# Altium project BEAGLEBONEBLACK_REV A5B.PrjPcb (part 3 of 5)

## Sheet P04_Processor 2 or 3, USB and Serial.SchDoc
size 513 x 386 mm
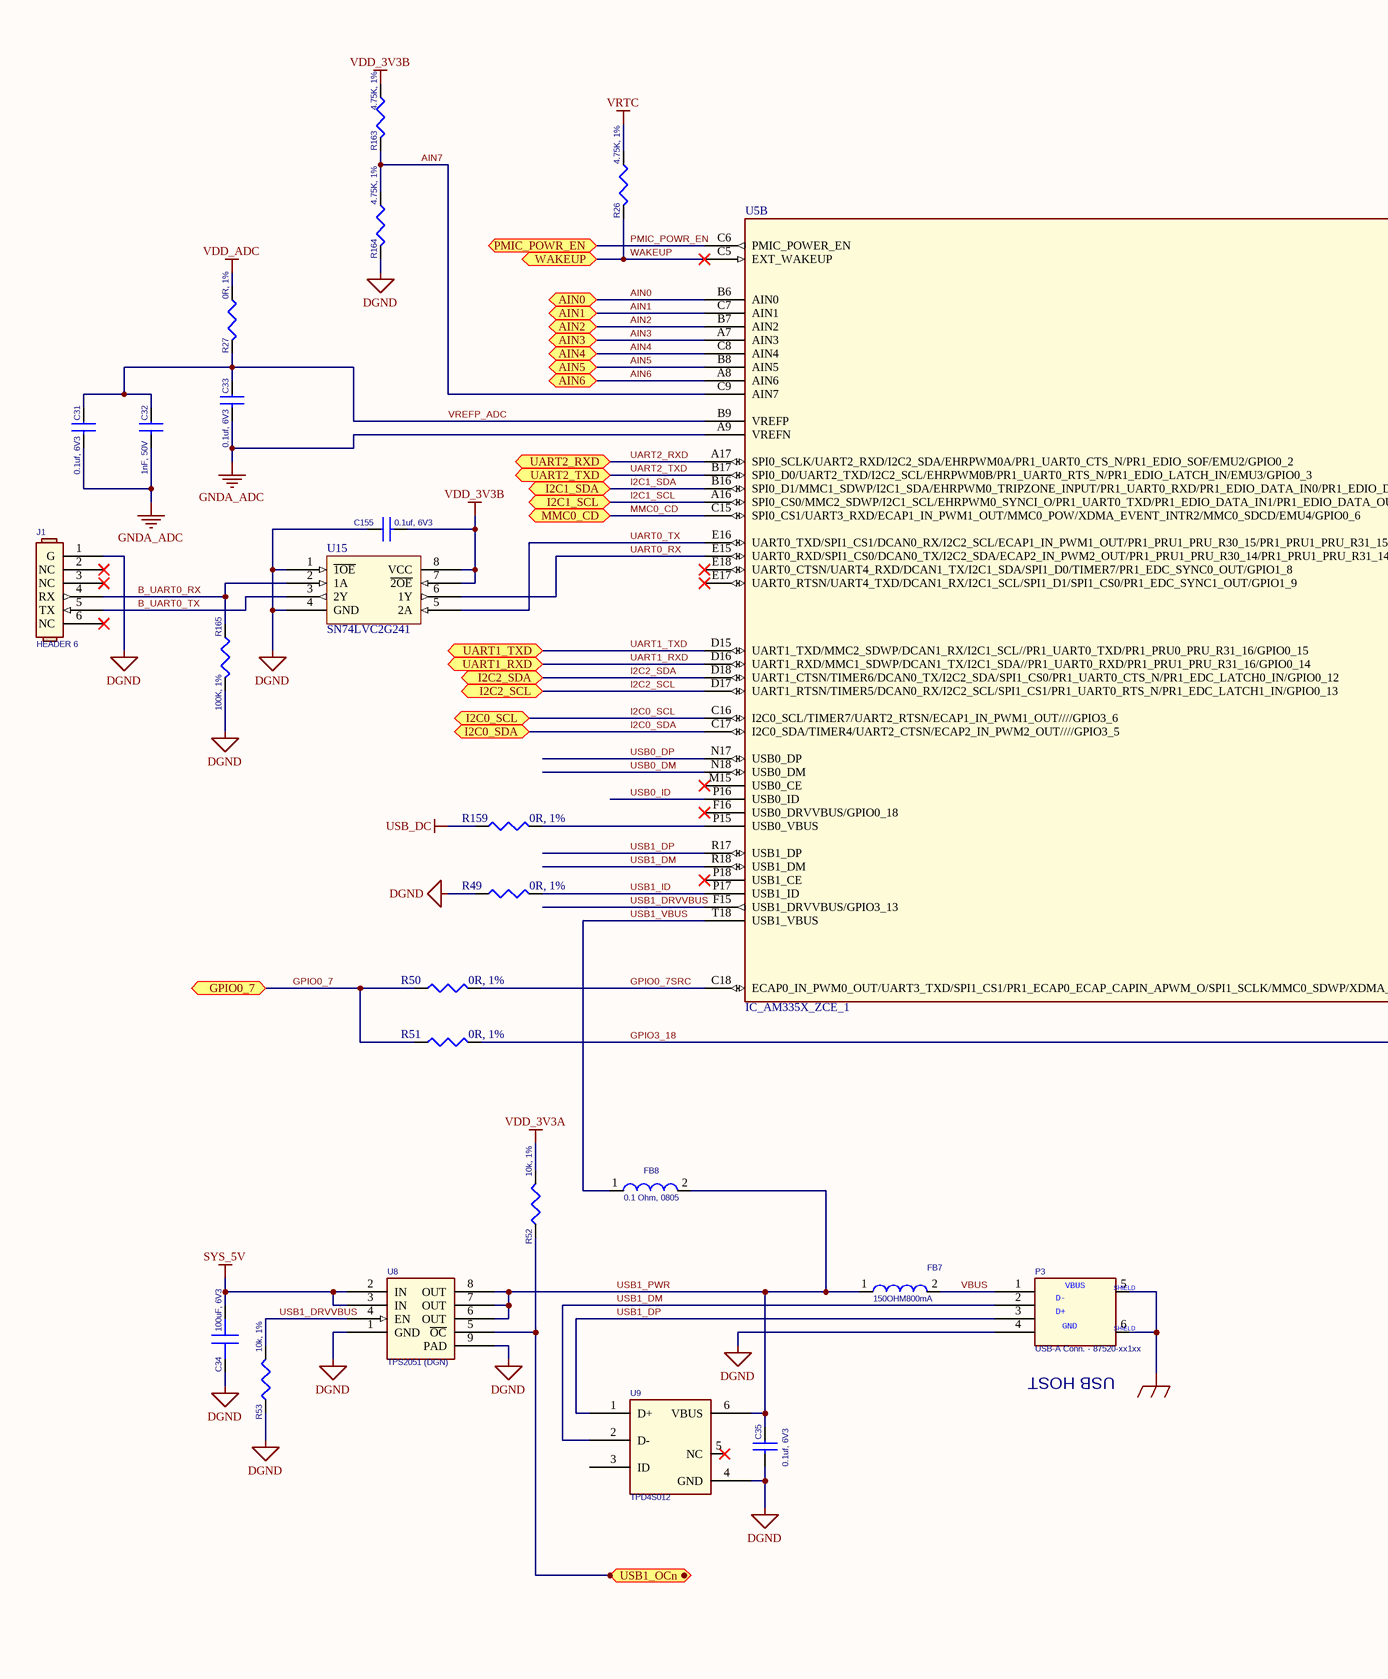
[diagram p3: P04_Processor 2 or 3, USB and Serial.SchDoc, left]
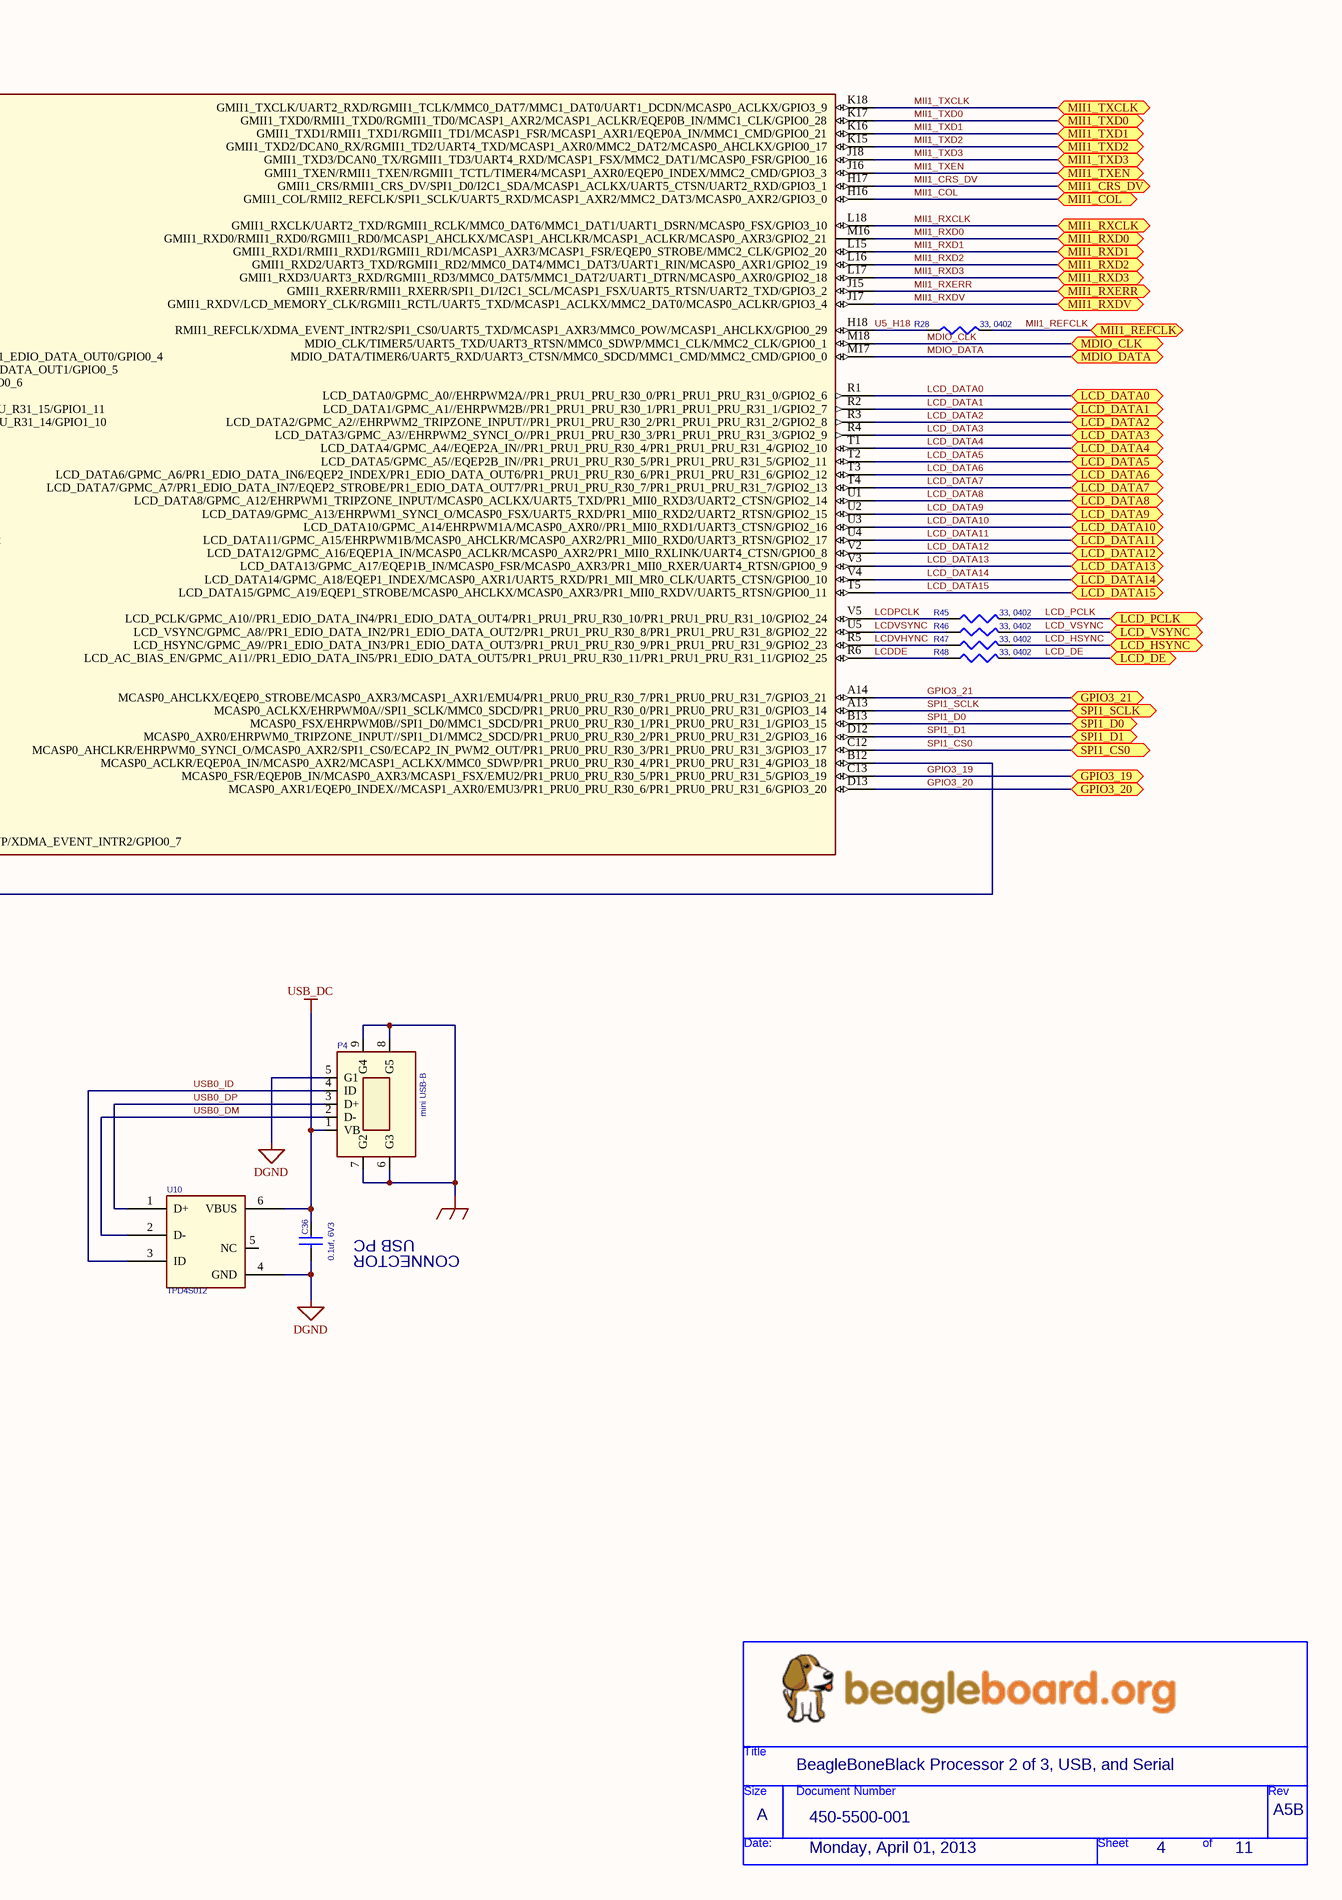
[diagram p4: P04_Processor 2 or 3, USB and Serial.SchDoc, right]

### Parts
(Parts that share a designator on the sheet are numbered #1, #2 ... from top to bottom, then left to right.)
*#4  Page Create Date: Monday, April 01, 2013  Doc: 450-5500-001  RevCode: A5B  Title: BeagleBoneBlack Processor 2 of 3, USB, and Serial  Page Size: A  Page Number: 4  Page Count: 11  (hidden comment: BeagleBoard_org)  (graphical)
C31  0.1uf, 6V3  [402]
C32  1nF, 50V  [402]
C33  0.1uf, 6V3  [402]
C34  100uF, 6V3  [RD205SMD_250D]
C35  0.1uf, 6V3  [402]
C36  0.1uf, 6V3  [402]
C155  0.1uf, 6V3  [402]
FB7  150OHM800mA  [SM-7351-IND-0805]
FB8  0.1 Ohm, 0805  [SM-7351-IND-0805]
J1  HEADER 6  [SIP6]
P3  USB-A Conn. - 87520-xx1xx  [usb_a_sh]
P4  mini USB-B  [USB5MINI_4SHIELDED_SMD-5]
R26  4.75K, 1%  [402]
R27  0R, 1%  [402]
R28  33, 0402  [402]
R45  33, 0402  [402]
R46  33, 0402  [402]
R47  33, 0402  [402]
R48  33, 0402  [402]
R49  0R, 1%  [402]
R50  0R, 1%  [402]
R51  0R, 1%  [402]
R52  10k, 1%  [402]
R53  10k, 1%  [402]
R159  0R, 1%  [402]
R163  4.75K, 1%  [402]
R164  4.75K, 1%  [402]
R165  100K, 1%  [402]
U5  IC_AM335X_ZCE_1  [am33xx_15x15]  (part B of 3)
U8  TPS2051 (DGN)  [DGN-16X60]
U9  TPD4S012  [U_6_DRY]
U10  TPD4S012  [U_6_DRY]
U15  SN74LVC2G241  [U_8_DCU]

### Ports
AIN0, AIN1, AIN2, AIN3, AIN4, AIN5, AIN6, GPIO0_7, GPIO3_19, GPIO3_20, GPIO3_21, I2C0_SCL, I2C0_SDA, I2C1_SCL, I2C1_SDA, I2C2_SCL, I2C2_SDA, LCD_DATA0, LCD_DATA1, LCD_DATA2, LCD_DATA3, LCD_DATA4, LCD_DATA5, LCD_DATA6, LCD_DATA7, LCD_DATA8, LCD_DATA9, LCD_DATA10, LCD_DATA11, LCD_DATA12, LCD_DATA13, LCD_DATA14, LCD_DATA15, LCD_DE, LCD_HSYNC, LCD_PCLK, LCD_VSYNC, MDIO_CLK, MDIO_DATA, MII1_COL, MII1_CRS_DV, MII1_REFCLK, MII1_RXCLK, MII1_RXD0, MII1_RXD1, MII1_RXD2, MII1_RXD3, MII1_RXDV, MII1_RXERR, MII1_TXCLK, MII1_TXD0, MII1_TXD1, MII1_TXD2, MII1_TXD3, MII1_TXEN, MMC0_CD, PMIC_POWR_EN, SPI1_CS0, SPI1_D0, SPI1_D1, SPI1_SCLK, UART1_RXD, UART1_TXD, UART2_RXD, UART2_TXD, USB1_OCn, WAKEUP

### Nets
DGND: C34.2 C35.2 C36.2 C155.1 J1.1(G) P3.4(P4) P4.5(G1) R49.1 R53.2(P2) R164.2 R165.2 U8.1(GND) U8.9(PAD) U9.4(GND) U10.4(GND) U15.1(~{1OE}) U15.4(GND)
GND_EARTH: P3.5(SHELD1) P3.6(PAD4) P4.6(G3) P4.7(G2) P4.8(G5) P4.9(G4)
GNDA_ADC: C31.2 C32.2 C33.2 U5.A9(VREFN)
SYS_5V: C34.1 U8.2(IN) U8.3(IN)
USB_DC: C36.1 P4.1(VB) R159.1 U10.6(VBUS)
VDD_3V3A: R52.1(P1)
VDD_3V3B: C155.2 R163.1 U15.7(~{2OE}) U15.8(VCC)
VDD_ADC: R27.1
VRTC: R26.1
AIN0: U5.B6(AIN0) ; port AIN0
AIN1: U5.C7(AIN1) ; port AIN1
AIN2: U5.B7(AIN2) ; port AIN2
AIN3: U5.A7(AIN3) ; port AIN3
AIN4: U5.C8(AIN4) ; port AIN4
AIN5: U5.B8(AIN5) ; port AIN5
AIN6: U5.A8(AIN6) ; port AIN6
AIN7: R163.2 R164.1 U5.C9(AIN7)
B_UART0_RX: J1.4(RX) R165.1 U15.2(1A)
B_UART0_TX: J1.5(TX) U15.3(2Y)
GPIO0_7: R50.1 R51.1 ; port GPIO0_7
GPIO0_7SRC: R50.2 U5.C18(ECAP0_IN_PWM0_OUT/UART3_TXD/SPI1_CS1/PR1_ECAP0_ECAP_CAPIN_APWM_O/SPI1_SCLK/MMC0_SDWP/XDMA_EVENT_INTR2/GPIO0_7)
GPIO3_18: R51.2 U5.B12(MCASP0_ACLKR/EQEP0A_IN/MCASP0_AXR2/MCASP1_ACLKX/MMC0_SDWP/PR1_PRU0_PRU_R30_4/PR1_PRU0_PRU_R31_4/GPIO3_18)
GPIO3_19: U5.C13(MCASP0_FSR/EQEP0B_IN/MCASP0_AXR3/MCASP1_FSX/EMU2/PR1_PRU0_PRU_R30_5/PR1_PRU0_PRU_R31_5/GPIO3_19) ; port GPIO3_19
GPIO3_20: U5.D13(MCASP0_AXR1/EQEP0_INDEX//MCASP1_AXR0/EMU3/PR1_PRU0_PRU_R30_6/PR1_PRU0_PRU_R31_6/GPIO3_20) ; port GPIO3_20
GPIO3_21: U5.A14(MCASP0_AHCLKX/EQEP0_STROBE/MCASP0_AXR3/MCASP1_AXR1/EMU4/PR1_PRU0_PRU_R30_7/PR1_PRU0_PRU_R31_7/GPIO3_21) ; port GPIO3_21
I2C0_SCL: U5.C16(I2C0_SCL/TIMER7/UART2_RTSN/ECAP1_IN_PWM1_OUT////GPIO3_6) ; port I2C0_SCL
I2C0_SDA: U5.C17(I2C0_SDA/TIMER4/UART2_CTSN/ECAP2_IN_PWM2_OUT////GPIO3_5) ; port I2C0_SDA
I2C1_SCL: U5.A16(SPI0_CS0/MMC2_SDWP/I2C1_SCL/EHRPWM0_SYNCI_O/PR1_UART0_TXD/PR1_EDIO_DATA_IN1/PR1_EDIO_DATA_OUT1/GPIO0_5) ; port I2C1_SCL
I2C1_SDA: U5.B16(SPI0_D1/MMC1_SDWP/I2C1_SDA/EHRPWM0_TRIPZONE_INPUT/PR1_UART0_RXD/PR1_EDIO_DATA_IN0/PR1_EDIO_DATA_OUT0/GPIO0_4) ; port I2C1_SDA
I2C2_SCL: U5.D17(UART1_RTSN/TIMER5/DCAN0_RX/I2C2_SCL/SPI1_CS1/PR1_UART0_RTS_N/PR1_EDC_LATCH1_IN/GPIO0_13) ; port I2C2_SCL
I2C2_SDA: U5.D18(UART1_CTSN/TIMER6/DCAN0_TX/I2C2_SDA/SPI1_CS0/PR1_UART0_CTS_N/PR1_EDC_LATCH0_IN/GPIO0_12) ; port I2C2_SDA
LCD_DATA0: U5.R1(LCD_DATA0/GPMC_A0//EHRPWM2A//PR1_PRU1_PRU_R30_0/PR1_PRU1_PRU_R31_0/GPIO2_6) ; port LCD_DATA0
LCD_DATA1: U5.R2(LCD_DATA1/GPMC_A1//EHRPWM2B//PR1_PRU1_PRU_R30_1/PR1_PRU1_PRU_R31_1/GPIO2_7) ; port LCD_DATA1
LCD_DATA2: U5.R3(LCD_DATA2/GPMC_A2//EHRPWM2_TRIPZONE_INPUT//PR1_PRU1_PRU_R30_2/PR1_PRU1_PRU_R31_2/GPIO2_8) ; port LCD_DATA2
LCD_DATA3: U5.R4(LCD_DATA3/GPMC_A3//EHRPWM2_SYNCI_O//PR1_PRU1_PRU_R30_3/PR1_PRU1_PRU_R31_3/GPIO2_9) ; port LCD_DATA3
LCD_DATA4: U5.T1(LCD_DATA4/GPMC_A4//EQEP2A_IN//PR1_PRU1_PRU_R30_4/PR1_PRU1_PRU_R31_4/GPIO2_10) ; port LCD_DATA4
LCD_DATA5: U5.T2(LCD_DATA5/GPMC_A5//EQEP2B_IN//PR1_PRU1_PRU_R30_5/PR1_PRU1_PRU_R31_5/GPIO2_11) ; port LCD_DATA5
LCD_DATA6: U5.T3(LCD_DATA6/GPMC_A6/PR1_EDIO_DATA_IN6/EQEP2_INDEX/PR1_EDIO_DATA_OUT6/PR1_PRU1_PRU_R30_6/PR1_PRU1_PRU_R31_6/GPIO2_12) ; port LCD_DATA6
LCD_DATA7: U5.T4(LCD_DATA7/GPMC_A7/PR1_EDIO_DATA_IN7/EQEP2_STROBE/PR1_EDIO_DATA_OUT7/PR1_PRU1_PRU_R30_7/PR1_PRU1_PRU_R31_7/GPIO2_13) ; port LCD_DATA7
LCD_DATA8: U5.U1(LCD_DATA8/GPMC_A12/EHRPWM1_TRIPZONE_INPUT/MCASP0_ACLKX/UART5_TXD/PR1_MII0_RXD3/UART2_CTSN/GPIO2_14) ; port LCD_DATA8
LCD_DATA9: U5.U2(LCD_DATA9/GPMC_A13/EHRPWM1_SYNCI_O/MCASP0_FSX/UART5_RXD/PR1_MII0_RXD2/UART2_RTSN/GPIO2_15) ; port LCD_DATA9
LCD_DATA10: U5.U3(LCD_DATA10/GPMC_A14/EHRPWM1A/MCASP0_AXR0//PR1_MII0_RXD1/UART3_CTSN/GPIO2_16) ; port LCD_DATA10
LCD_DATA11: U5.U4(LCD_DATA11/GPMC_A15/EHRPWM1B/MCASP0_AHCLKR/MCASP0_AXR2/PR1_MII0_RXD0/UART3_RTSN/GPIO2_17) ; port LCD_DATA11
LCD_DATA12: U5.V2(LCD_DATA12/GPMC_A16/EQEP1A_IN/MCASP0_ACLKR/MCASP0_AXR2/PR1_MII0_RXLINK/UART4_CTSN/GPIO0_8) ; port LCD_DATA12
LCD_DATA13: U5.V3(LCD_DATA13/GPMC_A17/EQEP1B_IN/MCASP0_FSR/MCASP0_AXR3/PR1_MII0_RXER/UART4_RTSN/GPIO0_9) ; port LCD_DATA13
LCD_DATA14: U5.V4(LCD_DATA14/GPMC_A18/EQEP1_INDEX/MCASP0_AXR1/UART5_RXD/PR1_MII_MR0_CLK/UART5_CTSN/GPIO0_10) ; port LCD_DATA14
LCD_DATA15: U5.T5(LCD_DATA15/GPMC_A19/EQEP1_STROBE/MCASP0_AHCLKX/MCASP0_AXR3/PR1_MII0_RXDV/UART5_RTSN/GPIO0_11) ; port LCD_DATA15
LCD_DE: R48.2 ; port LCD_DE
LCD_HSYNC: R47.2 ; port LCD_HSYNC
LCD_PCLK: R45.2 ; port LCD_PCLK
LCD_VSYNC: R46.2 ; port LCD_VSYNC
LCDDE: R48.1 U5.R6(LCD_AC_BIAS_EN/GPMC_A11//PR1_EDIO_DATA_IN5/PR1_EDIO_DATA_OUT5/PR1_PRU1_PRU_R30_11/PR1_PRU1_PRU_R31_11/GPIO2_25)
LCDPCLK: R45.1 U5.V5(LCD_PCLK/GPMC_A10//PR1_EDIO_DATA_IN4/PR1_EDIO_DATA_OUT4/PR1_PRU1_PRU_R30_10/PR1_PRU1_PRU_R31_10/GPIO2_24)
LCDVHYNC: R47.1 U5.R5(LCD_HSYNC/GPMC_A9//PR1_EDIO_DATA_IN3/PR1_EDIO_DATA_OUT3/PR1_PRU1_PRU_R30_9/PR1_PRU1_PRU_R31_9/GPIO2_23)
LCDVSYNC: R46.1 U5.U5(LCD_VSYNC/GPMC_A8//PR1_EDIO_DATA_IN2/PR1_EDIO_DATA_OUT2/PR1_PRU1_PRU_R30_8/PR1_PRU1_PRU_R31_8/GPIO2_22)
MDIO_CLK: U5.M18(MDIO_CLK/TIMER5/UART5_TXD/UART3_RTSN/MMC0_SDWP/MMC1_CLK/MMC2_CLK/GPIO0_1) ; port MDIO_CLK
MDIO_DATA: U5.M17(MDIO_DATA/TIMER6/UART5_RXD/UART3_CTSN/MMC0_SDCD/MMC1_CMD/MMC2_CMD/GPIO0_0) ; port MDIO_DATA
MII1_COL: U5.H16(GMII1_COL/RMII2_REFCLK/SPI1_SCLK/UART5_RXD/MCASP1_AXR2/MMC2_DAT3/MCASP0_AXR2/GPIO3_0) ; port MII1_COL
MII1_CRS_DV: U5.H17(GMII1_CRS/RMII1_CRS_DV/SPI1_D0/I2C1_SDA/MCASP1_ACLKX/UART5_CTSN/UART2_RXD/GPIO3_1) ; port MII1_CRS_DV
MII1_REFCLK: R28.2 ; port MII1_REFCLK
MII1_RXCLK: U5.L18(GMII1_RXCLK/UART2_TXD/RGMII1_RCLK/MMC0_DAT6/MMC1_DAT1/UART1_DSRN/MCASP0_FSX/GPIO3_10) ; port MII1_RXCLK
MII1_RXD0: U5.M16(GMII1_RXD0/RMII1_RXD0/RGMII1_RD0/MCASP1_AHCLKX/MCASP1_AHCLKR/MCASP1_ACLKR/MCASP0_AXR3/GPIO2_21) ; port MII1_RXD0
MII1_RXD1: U5.L15(GMII1_RXD1/RMII1_RXD1/RGMII1_RD1/MCASP1_AXR3/MCASP1_FSR/EQEP0_STROBE/MMC2_CLK/GPIO2_20) ; port MII1_RXD1
MII1_RXD2: U5.L16(GMII1_RXD2/UART3_TXD/RGMII1_RD2/MMC0_DAT4/MMC1_DAT3/UART1_RIN/MCASP0_AXR1/GPIO2_19) ; port MII1_RXD2
MII1_RXD3: U5.L17(GMII1_RXD3/UART3_RXD/RGMII1_RD3/MMC0_DAT5/MMC1_DAT2/UART1_DTRN/MCASP0_AXR0/GPIO2_18) ; port MII1_RXD3
MII1_RXDV: U5.J17(GMII1_RXDV/LCD_MEMORY_CLK/RGMII1_RCTL/UART5_TXD/MCASP1_ACLKX/MMC2_DAT0/MCASP0_ACLKR/GPIO3_4) ; port MII1_RXDV
MII1_RXERR: U5.J15(GMII1_RXERR/RMII1_RXERR/SPI1_D1/I2C1_SCL/MCASP1_FSX/UART5_RTSN/UART2_TXD/GPIO3_2) ; port MII1_RXERR
MII1_TXCLK: U5.K18(GMII1_TXCLK/UART2_RXD/RGMII1_TCLK/MMC0_DAT7/MMC1_DAT0/UART1_DCDN/MCASP0_ACLKX/GPIO3_9) ; port MII1_TXCLK
MII1_TXD0: U5.K17(GMII1_TXD0/RMII1_TXD0/RGMII1_TD0/MCASP1_AXR2/MCASP1_ACLKR/EQEP0B_IN/MMC1_CLK/GPIO0_28) ; port MII1_TXD0
MII1_TXD1: U5.K16(GMII1_TXD1/RMII1_TXD1/RGMII1_TD1/MCASP1_FSR/MCASP1_AXR1/EQEP0A_IN/MMC1_CMD/GPIO0_21) ; port MII1_TXD1
MII1_TXD2: U5.K15(GMII1_TXD2/DCAN0_RX/RGMII1_TD2/UART4_TXD/MCASP1_AXR0/MMC2_DAT2/MCASP0_AHCLKX/GPIO0_17) ; port MII1_TXD2
MII1_TXD3: U5.J18(GMII1_TXD3/DCAN0_TX/RGMII1_TD3/UART4_RXD/MCASP1_FSX/MMC2_DAT1/MCASP0_FSR/GPIO0_16) ; port MII1_TXD3
MII1_TXEN: U5.J16(GMII1_TXEN/RMII1_TXEN/RGMII1_TCTL/TIMER4/MCASP1_AXR0/EQEP0_INDEX/MMC2_CMD/GPIO3_3) ; port MII1_TXEN
MMC0_CD: U5.C15(SPI0_CS1/UART3_RXD/ECAP1_IN_PWM1_OUT/MMC0_POW/XDMA_EVENT_INTR2/MMC0_SDCD/EMU4/GPIO0_6) ; port MMC0_CD
PMIC_POWR_EN: U5.C6(PMIC_POWER_EN) ; port PMIC_POWR_EN
SPI1_CS0: U5.C12(MCASP0_AHCLKR/EHRPWM0_SYNCI_O/MCASP0_AXR2/SPI1_CS0/ECAP2_IN_PWM2_OUT/PR1_PRU0_PRU_R30_3/PR1_PRU0_PRU_R31_3/GPIO3_17) ; port SPI1_CS0
SPI1_D0: U5.B13(MCASP0_FSX/EHRPWM0B//SPI1_D0/MMC1_SDCD/PR1_PRU0_PRU_R30_1/PR1_PRU0_PRU_R31_1/GPIO3_15) ; port SPI1_D0
SPI1_D1: U5.D12(MCASP0_AXR0/EHRPWM0_TRIPZONE_INPUT//SPI1_D1/MMC2_SDCD/PR1_PRU0_PRU_R30_2/PR1_PRU0_PRU_R31_2/GPIO3_16) ; port SPI1_D1
SPI1_SCLK: U5.A13(MCASP0_ACLKX/EHRPWM0A//SPI1_SCLK/MMC0_SDCD/PR1_PRU0_PRU_R30_0/PR1_PRU0_PRU_R31_0/GPIO3_14) ; port SPI1_SCLK
U5_H18: R28.1 U5.H18(RMII1_REFCLK/XDMA_EVENT_INTR2/SPI1_CS0/UART5_TXD/MCASP1_AXR3/MMC0_POW/MCASP1_AHCLKX/GPIO0_29)
UART0_RX: U5.E15(UART0_RXD/SPI1_CS0/DCAN0_TX/I2C2_SDA/ECAP2_IN_PWM2_OUT/PR1_PRU1_PRU_R30_14/PR1_PRU1_PRU_R31_14/GPIO1_10) U15.6(1Y)
UART0_TX: U5.E16(UART0_TXD/SPI1_CS1/DCAN0_RX/I2C2_SCL/ECAP1_IN_PWM1_OUT/PR1_PRU1_PRU_R30_15/PR1_PRU1_PRU_R31_15/GPIO1_11) U15.5(2A)
UART1_RXD: U5.D16(UART1_RXD/MMC1_SDWP/DCAN1_TX/I2C1_SDA//PR1_UART0_RXD/PR1_PRU1_PRU_R31_16/GPIO0_14) ; port UART1_RXD
UART1_TXD: U5.D15(UART1_TXD/MMC2_SDWP/DCAN1_RX/I2C1_SCL//PR1_UART0_TXD/PR1_PRU0_PRU_R31_16/GPIO0_15) ; port UART1_TXD
UART2_RXD: U5.A17(SPI0_SCLK/UART2_RXD/I2C2_SDA/EHRPWM0A/PR1_UART0_CTS_N/PR1_EDIO_SOF/EMU2/GPIO0_2) ; port UART2_RXD
UART2_TXD: U5.B17(SPI0_D0/UART2_TXD/I2C2_SCL/EHRPWM0B/PR1_UART0_RTS_N/PR1_EDIO_LATCH_IN/EMU3/GPIO0_3) ; port UART2_TXD
USB0_DM: P4.2(D-) U5.N18(USB0_DM) U10.2(D-)
USB0_DP: P4.3(D+) U5.N17(USB0_DP) U10.1(D+)
USB0_ID: P4.4(ID) U5.P16(USB0_ID) U10.3(ID)
USB1_DM: P3.2(P2) U5.R18(USB1_DM) U9.2(D-)
USB1_DP: P3.3(P3) U5.R17(USB1_DP) U9.1(D+)
USB1_DRVVBUS: R53.1(P1) U5.F15(USB1_DRVVBUS/GPIO3_13) U8.4(EN)
USB1_ID: R49.2 U5.P17(USB1_ID)
USB1_OCn: R52.2(P2) U8.5(~{OC}) ; port USB1_OCn
USB1_PWR: C35.1 FB7.1 FB8.2 U8.6(OUT) U8.7(OUT) U8.8(OUT) U9.6(VBUS)
USB1_VBUS: FB8.1 U5.T18(USB1_VBUS)
VBUS: FB7.2 P3.1(P1)
VREFP_ADC: C31.1 C32.1 C33.1 R27.2 U5.B9(VREFP)
WAKEUP: R26.2 U5.C5(EXT_WAKEUP) ; port WAKEUP
NetR159_2: R159.2 U5.P15(USB0_VBUS)

Not connected (* = marked no-connect by the designer): J1 2(NC)* 3(NC)* 6(NC)*; U5 E17(UART0_RTSN/UART4_TXD/DCAN1_RX/I2C1_SCL/SPI1_D1/SPI1_CS0/PR1_EDC_SYNC1_OUT/GPIO1_9)* E18(UART0_CTSN/UART4_RXD/DCAN1_TX/I2C1_SDA/SPI1_D0/TIMER7/PR1_EDC_SYNC0_OUT/GPIO1_8)* F16(USB0_DRVVBUS/GPIO0_18)* M15(USB0_CE)* P18(USB1_CE)*; U9 3(ID) 5(NC)*; U10 5(NC)

### Notes on the sheet
- (near P3) USB HOST
- USB PC
- CONNECTOR
- (in symbol BeagleBoard_org) Title; Size; Document Number; Rev; Date:; Sheet; of
- (in symbol CONN_54819-0578_2) VBUS; SHIELD; D-; D+; GND

### Library data of the parts
C31 C33 C35 C36 C155 = CAP_0.1uF_X7R_16V_10% 0402: CAP CER 0.1UF 6.3V 10% X5R 0402; Manufacturer: TDK Corporation; Manufacturer Part Number: C1005X5R0J104K050BA; Capacitance: 0.1µF; Supplier 1: Digi-Key; Supplier Part Number 1: 445-1266-6-ND; RoHS: RoHS Compliant; Category: Capacitors; Stock 1: 127604; Pricing 1: 1=0.1, 10=0.026, 100=0.0121, 250=0.00992, 500=0.00848, 1000=0.0066, 5000=0.0055 (USD); Voltage - Rated: 6.3V; Tolerance: ±10%; Temperature Coefficient: X5R; Mounting Type: Surface Mount, MLCC; Operating Temperature: -55°C ~ 85°C; Applications: General Purpose; Ratings: -; Package / Case: 0402 (1005 Metric); Size / Dimension: 0.039" L x 0.020" W (1.00mm x 0.50mm); Height - Seated (Max): -; Thickness (Max): 0.022" (0.55mm); Lead Spacing: -; Features: -; Packaging: Digi-Reel®; Lead Style: -; ComponentLink1URL: http://product.tdk.com/capacitor/mlcc/en/documents/mlcc_commercial_general_en.pdf; ComponentLink1Description: http://product.tdk.com/capacitor/mlcc/en/documents/mlcc_commercial_general_en.pdf
C32 = CAP_0.001_X7R_50V_5%_0402: CAP CER 1000PF 16V 10% X7R 0402; Manufacturer: Yageo; Manufacturer Part Number: CC0402KRX7R7BB102; Supplier 1: Digi-Key; Supplier Part Number 1: 311-1352-6-ND; RoHS: RoHS Compliant; Category: Capacitors; Stock 1: 394472; Pricing 1: 1=0.1, 10=0.012, 25=0.0088, 100=0.0057, 250=0.00464, 500=0.00396, 1000=0.00309, 2500=0.00278, 5000=0.00258 (USD); Capacitance: 1000pF; Voltage - Rated: 16V; Tolerance: ±10%; Temperature Coefficient: X7R; Mounting Type: Surface Mount, MLCC; Operating Temperature: -55°C ~ 125°C; Applications: General Purpose; Ratings: -; Package / Case: 0402 (1005 Metric); Size / Dimension: 0.039" L x 0.020" W (1.00mm x 0.50mm); Height - Seated (Max): -; Thickness (Max): 0.022" (0.55mm); Lead Spacing: -; Features: -; Packaging: Digi-Reel®; Lead Style: -; ComponentLink1URL: http://www.yageo.com/documents/recent/UPY-GPHC_X7R_6.3V-to-50V_8.pdf; ComponentLink1Description: http://www.yageo.com/documents/recent/UPY-GPHC_X7R_6.3V-to-50V_8.pdf
C34 = CAP SMD: CAP ALUM 100UF 6.3V 20% SMD; Manufacturer: Cornell Dubilier Electronics (CDE); Manufacturer Part Number: AVE107M06D16T-F; Capacitance: 100µF; Lifetime @ Temp.: 2000 Hrs @ 85°C; Ripple Current: 120mA; ESR (Equivalent Series Resistance): 4.64 Ohm; Surface Mount Land Size: 0.260" L x 0.260" W (6.60mm x 6.60mm); Supplier 1: Digi-Key; Supplier Part Number 1: 338-1787-6-ND; RoHS: RoHS Compliant; Category: Capacitors; Stock 1: 2601; Pricing 1: 1=0.17, 10=0.16, 100=0.133, 250=0.11844, 500=0.0987 (USD); Voltage Rating: 6.3V; Tolerance: ±20%; Operating Temperature: -40°C ~ 85°C; Features: General Purpose; Impedance: -; Mounting Type: Surface Mount; Package / Case: Radial, Can - SMD; Size / Dimension: 0.248" Dia (6.30mm); Height - Seated (Max): 0.209" (5.30mm); Lead Spacing: -; Packaging: Digi-Reel®; ComponentLink1URL: http://www.cde.com/catalogs/AVE.pdf; ComponentLink1Description: http://www.cde.com/catalogs/AVE.pdf
FB7 = FER_180_200_0: FERRITE 800MA 150 OHM 0805 SMD; PartName: FerriteBead150ohm800mA; Mfr: Steward; MfrNum: LI0805H151R-10; TIIntPartnumber: 1L0010; Manufacturer: Laird-Signal Integrity Products; Vendor: Digikey; Impedance @ Frequency: 150 Ohm @ 100MHz; DC Resistance (DCR): 150 mOhm Max; Filter Type: Differential Mode - Single; Supplier 1: Digi-Key; Supplier Part Number 1: 240-2384-6-ND; Manufacturer Part Number: LI0805H151R-10; RoHS: RoHS Compliant; Category: Filters; Stock 1: 3694; Pricing 1: 1=0.1, 10=0.07, 25=0.064, 50=0.0574, 100=0.0421, 250=0.03064, 500=0.02808, 1000=0.02424 (USD); Current Rating: 800mA; Package / Case: 0805 (2012 Metric); Mounting Type: Surface Mount; Packaging: Digi-Reel®; Height (Max): 0.043" (1.10mm); Size / Dimension: 0.079" L x 0.049" W (2.00mm x 1.25mm); ComponentLink1URL: http://www.lairdtech.com/WorkArea/linkit.aspx?LinkIdentifier=id&ItemID=4912; ComponentLink1Description: http://www.lairdtech.com/WorkArea/linkit.aspx?LinkIdentifier=id&ItemID=4912
FB8 = FER_180_200_0: RES .10 OHM 1/8W 5% 0805; Manufacturer: CTS Resistor Products; Manufacturer Part Number: 73L3R10J; Resistance (Ohms): 0.1; Power (Watts): 0.125W, 1/8W; Temperature Coefficient: ±200ppm/°C; Supplier 1: Digi-Key; Supplier Part Number 1: 73L3R10JDKR-ND; RoHS: RoHS Compliant; Category: Resistors; Stock 1: 1186; Pricing 1: 1=0.1, 10=0.066, 100=0.0267, 250=0.0204, 500=0.01632, 1000=0.01201 (USD); Composition: Thick Film; Features: Current Sense; Tolerance: ±5%; Package / Case: 0805 (2012 Metric); Supplier Device Package: 0805; Size / Dimension: 0.079" L x 0.049" W (2.00mm x 1.25mm); Height: 0.026" (0.65mm); Number of Terminations: 2; Packaging: Digi-Reel®; ComponentLink1URL: http://www.ctscorp.com/components/Datasheets/008-0337-0.pdf; ComponentLink1Description: http://www.ctscorp.com/components/Datasheets/008-0337-0.pdf
J1 = HDR_6x1: CONN HEADER 6POS, VERTICAL,  .100 STR TIN; Manufacturer: Samtec Inc; Manufacturer Part Number: FTR-110-03-G-D-06; Connector Type: Unshrouded; Number of Positions: 20; Number of Positions Loaded: 19; Pitch: 0.050" (1.27mm); Row Spacing: 0.100" (2.54mm); Supplier 1: Digi-Key; Supplier Part Number 1: FTR-110-03-G-D-06-ND; RoHS: RoHS Compliant; Category: Connectors, Interconnects; Stock 1: 0; Pricing 1: 1=4.47 (USD); Number of Rows: 2; Contact Mating Length: 0.125" (3.18mm); Mounting Type: Surface Mount; Termination: Solder; Features: -; Contact Finish: Gold; Contact Finish Thickness: 10µin (0.25µm); Color: Black; Packaging: Tube; ComponentLink1URL: http://www.samtec.com/documents/webfiles/cpdf/FTR-1XX-XX-XX-D-X-XX-MKT.pdf; ComponentLink1Description: http://www.samtec.com/documents/webfiles/cpdf/FTR-1XX-XX-XX-D-X-XX-MKT.pdf; Height Stacking (Mating): -; Molding Height Above Board: 0.100" (2.54mm)
P3 = CONN_54819-0578_2: CONN RCPT USB TYPE A R/A PCB; Manufacturer: FCI; Manufacturer Part Number: 87520-0010BLF; CLASS: IO; TN: 224-0234-000; Number of Contacts: 4; Gender: Receptacle; Specifications: USB 2.0; Supplier 1: Digi-Key; Supplier Part Number 1: 609-1045-ND; RoHS: RoHS Compliant; Category: Connectors, Interconnects; Stock 1: 4363; Pricing 1: 1=0.78, 10=0.734, 25=0.6604, 50=0.587, 100=0.5626, 250=0.51368, 500=0.4892, 1000=0.40359, 2500=0.3669 (USD); Connector Type: USB - A; Mounting Type: Through Hole, Right Angle, Horizontal; Features: Board Lock; Packaging: Tube; Ingress Protection: -; ComponentLink1URL: http://portal.fciconnect.com/Comergent//fci/drawing/87520.pdf; ComponentLink1Description: http://portal.fciconnect.com/Comergent//fci/drawing/87520.pdf
P4 = MINI-USB-AB-SOCKET: CONN RCPT USB MINI B R/A SMD; Manufacturer: KYCON; Manufacturer Part Number: 0565790576; Order# 2: C-440247; ATLStockNo1: 4500.0223; Order#: KMAB-SMT-5S-S-30TR; Connector Type: USB - mini AB; Number of Contacts: 5; Gender: Receptacle; Specifications: USB 2.0 OTG; Manufacturer 2: AMP; Distributor: Deltron; Distributor 2: Tyco; Supplier 1: Digi-Key; Supplier Part Number 1: WM17122DKR-ND; RoHS: RoHS Compliant; Category: Connectors, Interconnects; Stock 1: 12426; Pricing 1: 1=2.92, 10=2.649, 25=2.4872, 50=2.3792, 100=2.271, 250=2.05468 (USD); Mounting Type: Surface Mount, Right Angle, Horizontal; Features: Shielded; Packaging: Digi-Reel®; Ingress Protection: -; ComponentLink1URL: http://www.molex.com/pdm_docs/sd/565790576_sd.pdf; ComponentLink1Description: http://www.molex.com/pdm_docs/sd/565790576_sd.pdf
R26 R163 R164 = RES_4.75K_1/16W_1%_0402: RES 4.75K OHM 1/16W 1% 0402 SMD; Manufacturer: Stackpole Electronics Inc; Manufacturer Part Number: RMCF0402FT4K75; Power (Watts): 0.063W, 1/16W; Temperature Coefficient: ±100ppm/°C; Supplier 1: Digi-Key; Supplier Part Number 1: RMCF0402FT4K75DKR-ND; RoHS: RoHS Compliant; Category: Resistors; Stock 1: 280917; Pricing 1: 1=0.04, 10=0.025, 50=0.0138, 100=0.0105, 250=0.0078, 500=0.00576, 1000=0.00384, 2500=0.00324, 5000=0.0027 (USD); Resistance (Ohms): 4.75k; Composition: Thick Film; Features: -; Tolerance: ±1%; Package / Case: 0402 (1005 Metric); Supplier Device Package: 0402; Size / Dimension: 0.039" L x 0.020" W (1.00mm x 0.50mm); Height: 0.016" (0.40mm); Number of Terminations: 2; Packaging: Digi-Reel®; ComponentLink1URL: http://www.seielect.com/Catalog/SEI-RMCF_RMCP.pdf; ComponentLink1Description: http://www.seielect.com/Catalog/SEI-RMCF_RMCP.pdf
R27 = RES_0_1/16W_1%_0402: RES 0.0 OHM 1/16W 0402 SMD; Manufacturer: Yageo; Manufacturer Part Number: RC0402JR-070RL; Resistance (Ohms): 0.0; Power (Watts): 0.063W, 1/16W; Tolerance: Jumper; Supplier 1: Digi-Key; Supplier Part Number 1: 311-0.0JRDKR-ND; RoHS: RoHS Compliant; Category: Resistors; Stock 1: 4904429; Pricing 1: 1=0.1, 10=0.012, 25=0.0092, 100=0.0055, 250=0.00476, 500=0.00336, 1000=0.00237, 2500=0.00206, 5000=0.00178 (USD); Composition: Thick Film; Features: -; Temperature Coefficient: -; Package / Case: 0402 (1005 Metric); Supplier Device Package: 0402; Size / Dimension: 0.039" L x 0.020" W (1.00mm x 0.50mm); Height: 0.016" (0.40mm); Number of Terminations: 2; Packaging: Digi-Reel®; ComponentLink1URL: http://www.yageo.com/documents/recent/PYu-RC0402_51_RoHS_L_6.pdf; ComponentLink1Description: http://www.yageo.com/documents/recent/PYu-RC0402_51_RoHS_L_6.pdf
R28 R45-R48 = RES_33_0402: RES 33 OHM 1/16W 5% 0402 SMD; Manufacturer: Panasonic Electronic Components; Manufacturer Part Number: ERJ-2GEJ330X; Resistance (Ohms): 33; Power (Watts): 0.1W, 1/10W; Temperature Coefficient: ±200ppm/°C; Supplier 1: Digi-Key; Supplier Part Number 1: P33JDKR-ND; RoHS: RoHS Compliant; Category: Resistors; Stock 1: 5879945; Pricing 1: 1=0.1, 50=0.0172, 100=0.0131, 250=0.00976, 500=0.0072, 1000=0.0048, 5000=0.00338 (USD); Composition: Thick Film; Features: -; Tolerance: ±5%; Package / Case: 0402 (1005 Metric); Supplier Device Package: 0402; Size / Dimension: 0.039" L x 0.020" W (1.00mm x 0.50mm); Height: 0.016" (0.40mm); Number of Terminations: 2; Packaging: Digi-Reel®; ComponentLink1URL: http://industrial.panasonic.com/www-cgi/jvcr13pz.cgi?E+PZ+3+AOA0001+ERJ2GEJ330X+7+WW; ComponentLink1Description: http://industrial.panasonic.com/www-cgi/jvcr13pz.cgi?E+PZ+3+AOA0001+ERJ2GEJ330X+7+WW
R49-R51 R159 = RES_0_1/16W_1%_0402: RES 0.0 OHM 1/16W 0402 SMD; Manufacturer: Yageo; Manufacturer Part Number: RC0402JR-070RL; Power (Watts): 0.063W, 1/16W; Resistance (Ohms): 0.0; Tolerance: Jumper; Category: Resistors; ComponentLink1Description: http://www.yageo.com/documents/recent/PYu-RC0402_51_RoHS_L_6.pdf; ComponentLink1URL: http://www.yageo.com/documents/recent/PYu-RC0402_51_RoHS_L_6.pdf; Composition: Thick Film; Features: -; Height: 0.016" (0.40mm); Number of Terminations: 2; Package / Case: 0402 (1005 Metric); Packaging: Digi-Reel®; Pricing 1: 1=0.1, 10=0.012, 25=0.0092, 100=0.0055, 250=0.00476, 500=0.00336, 1000=0.00237, 2500=0.00206, 5000=0.00178 (USD); RoHS: RoHS Compliant; Size / Dimension: 0.039" L x 0.020" W (1.00mm x 0.50mm); Stock 1: 4904429; Supplier 1: Digi-Key; Supplier Device Package: 0402; Supplier Part Number 1: 311-0.0JRDKR-ND; Temperature Coefficient: -
R52 R53 = RES SMD: RES 10K OHM 1/16W 5% 0402 SMD; Manufacturer: Rohm Semiconductor; Manufacturer Part Number: MCR01MZPJ103; Power (Watts): 0.063W, 1/16W; Temperature Coefficient: ±200ppm/°C; Supplier 1: Digi-Key; Supplier Part Number 1: RHM10KJDKR-ND; RoHS: RoHS Compliant; Category: Resistors; Stock 1: 452072; Pricing 1: 1=0.1, 10=0.019, 25=0.014, 100=0.0078, 250=0.00596, 500=0.00476, 1000=0.0035, 5000=0.00251 (USD); Resistance (Ohms): 10k; Composition: Thick Film; Features: Automotive AEC-Q200 Qualified; Tolerance: ±5%; Package / Case: 0402 (1005 Metric); Supplier Device Package: 0402 (1005 Metric); Size / Dimension: 0.039" L x 0.020" W (1.00mm x 0.50mm); Height: 0.016" (0.40mm); Number of Terminations: 2; Packaging: Digi-Reel®; ComponentLink1URL: http://rohmfs.rohm.com/en/products/databook/datasheet/passive/resistor/chip_resistor/mcr_a.pdf; ComponentLink1Description: http://rohmfs.rohm.com/en/products/databook/datasheet/passive/resistor/chip_resistor/mcr_a.pdf
R165 = RES_100K_1/16W_1%_0402: as R1 on sheet P02_Power Management; Category: Resistors; ComponentLink1Description: http://www.seielect.com/Catalog/SEI-RMCF_RMCP.pdf; ComponentLink1URL: http://www.seielect.com/Catalog/SEI-RMCF_RMCP.pdf; Composition: Thick Film; Features: -; Height: 0.016" (0.40mm); Number of Terminations: 2; Package / Case: 0402 (1005 Metric); Packaging: Digi-Reel®; Pricing 1: 1=0.04, 10=0.025, 50=0.0138, 100=0.0105, 250=0.0078, 500=0.00576, 1000=0.00384, 2500=0.00324, 5000=0.0027 (USD); Resistance (Ohms): 100k; RoHS: RoHS Compliant; Size / Dimension: 0.039" L x 0.020" W (1.00mm x 0.50mm); Stock 1: 851196; Supplier 1: Digi-Key; Supplier Device Package: 0402; Supplier Part Number 1: RMCF0402FT100KDKR-ND; Tolerance: ±1%
U5 = IC_AM335X_ZCE_1: SubArctic Cortex A8 Processor 15x15; PartName: AM335X_15x15; Mfr: TI; MfrNum: AM335x 15x15 FBGA ZCE; TIIntPartnumber: 1A0242; Manufacturer: Texas Instruments; Manufacturer Part Number: XAM3359ZCZ; Vendor: Arrow; Cost100: 10.00; Processor Type: ARM Microprocessor; Voltage: 1.06 V ~ 1.15 V; Cost10K: 10.00; Part Number: IC_AM335x_ZCE; Supplier 1: Digi-Key; Supplier Part Number 1: 296-35073-ND; RoHS: RoHS Compliant; Category: Integrated Circuits (ICs); Stock 1: 16; Pricing 1: 1=33.5, 10=30.988, 100=26.465, 250=24.28752, 500=23.115, 1000=21.775, 2500=21.105, 5000=20.6025, 10000=20.1 (USD); Features: -; Speed: -; Mounting Type: Surface Mount; Package / Case: 324-LFBGA; Supplier Device Package: 324-NFBGA(15x15); Packaging: Tray; ComponentLink1URL: http://www.ti.com/lit/ds/symlink/am3354.pdf; ComponentLink1Description: http://www.ti.com/lit/ds/symlink/am3354.pdf
U8 = TPS2061_0: IC 1.5A PWR DIST SWITCH 8-SOIC; Manufacturer: Texas Instruments; Manufacturer Part Number: TPS2051BDGNR; Number of Outputs: 1; Rds (On): 135 mOhm; Internal Switch(s): Yes; Current Limit: 1A; Voltage - Input: 2.7 V ~ 5.5 V; Supplier 1: Digi-Key; Supplier Part Number 1: 296-17313-6-ND; RoHS: RoHS Compliant; Category: Integrated Circuits (ICs); Stock 1: 7065; Pricing 1: 1=1.82, 10=1.642, 25=1.4708, 100=1.3224, 250=1.1742, 500=1.026, 1000=0.8493 (USD); Type: High Side Switch; Operating Temperature: -40°C ~ 85°C; Mounting Type: Surface Mount; Package / Case: 8-TSSOP, 8-MSOP (0.118", 3.00mm Width) Exposed Pad; Supplier Device Package: 8-MSOP-PowerPad; Packaging: Digi-Reel®; ComponentLink1URL: http://www.ti.com/lit/ds/symlink/tps2051b.pdf; ComponentLink1Description: http://www.ti.com/lit/ds/symlink/tps2051b.pdf
U9 U10 = PROT_TPD4S012: ESD 4channel USB Interface; Mfr: TI; MfrNum: TPD4S012DRY; TIIntPartnumber: 1A0233; Manufacturer: Texas Instruments; Manufacturer Part Number: TPD4S012DRYR; Vendor: Digikey; Cost100: 0.76; Cost10K: 0.23; Power (Watts): 60W; Number of Circuits: 4; PartName: TPD4S012; Supplier 1: Digi-Key; Supplier Part Number 1: 296-24244-6-ND; RoHS: RoHS Compliant; Category: Circuit Protection; Stock 1: 7978; Pricing 1: 1=0.78, 10=0.682, 25=0.6028, 100=0.2552, 250=0.25044, 500=0.2457, 750=0.24097 (USD); Voltage - Working: -; Voltage - Clamping: -; Technology: Mixed Technology; Applications: USB; Package / Case: 6-UFDFN; Supplier Device Package: 6-SON (1.45x1); Packaging: Digi-Reel®; ComponentLink1URL: http://www.ti.com/lit/ds/symlink/tpd4s012.pdf; ComponentLink1Description: http://www.ti.com/lit/ds/symlink/tpd4s012.pdf
U15 = SN74LVC2G241: IC BUFF/DVR TRI-ST DL 8VSSOP; Manufacturer: Texas Instruments; Manufacturer Part Number: SN74LVC2G241DCUR; Logic Type: Buffer/Line Driver, Non-Inverting; Number of Elements: 2; Number of Bits per Element: 1; Current - Output High, Low: 32mA, 32mA; Voltage - Supply: 1.65 V ~ 5.5 V; Supplier 1: Digi-Key; Supplier Part Number 1: 296-11936-6-ND; RoHS: RoHS Compliant; Category: Integrated Circuits (ICs); Stock 1: 28602; Pricing 1: 1=0.49, 10=0.428, 25=0.3756 (USD); Operating Temperature: -40°C ~ 85°C; Mounting Type: Surface Mount; Package / Case: 8-VFSOP (0.091", 2.30mm Width); Supplier Device Package: US8; Packaging: Digi-Reel®; ComponentLink1URL: http://www.ti.com/lit/ds/symlink/sn74lvc2g241.pdf; ComponentLink1Description: http://www.ti.com/lit/ds/symlink/sn74lvc2g241.pdf

## Sheet P05_Processor Page 3 of 3.SchDoc
size 513 x 386 mm
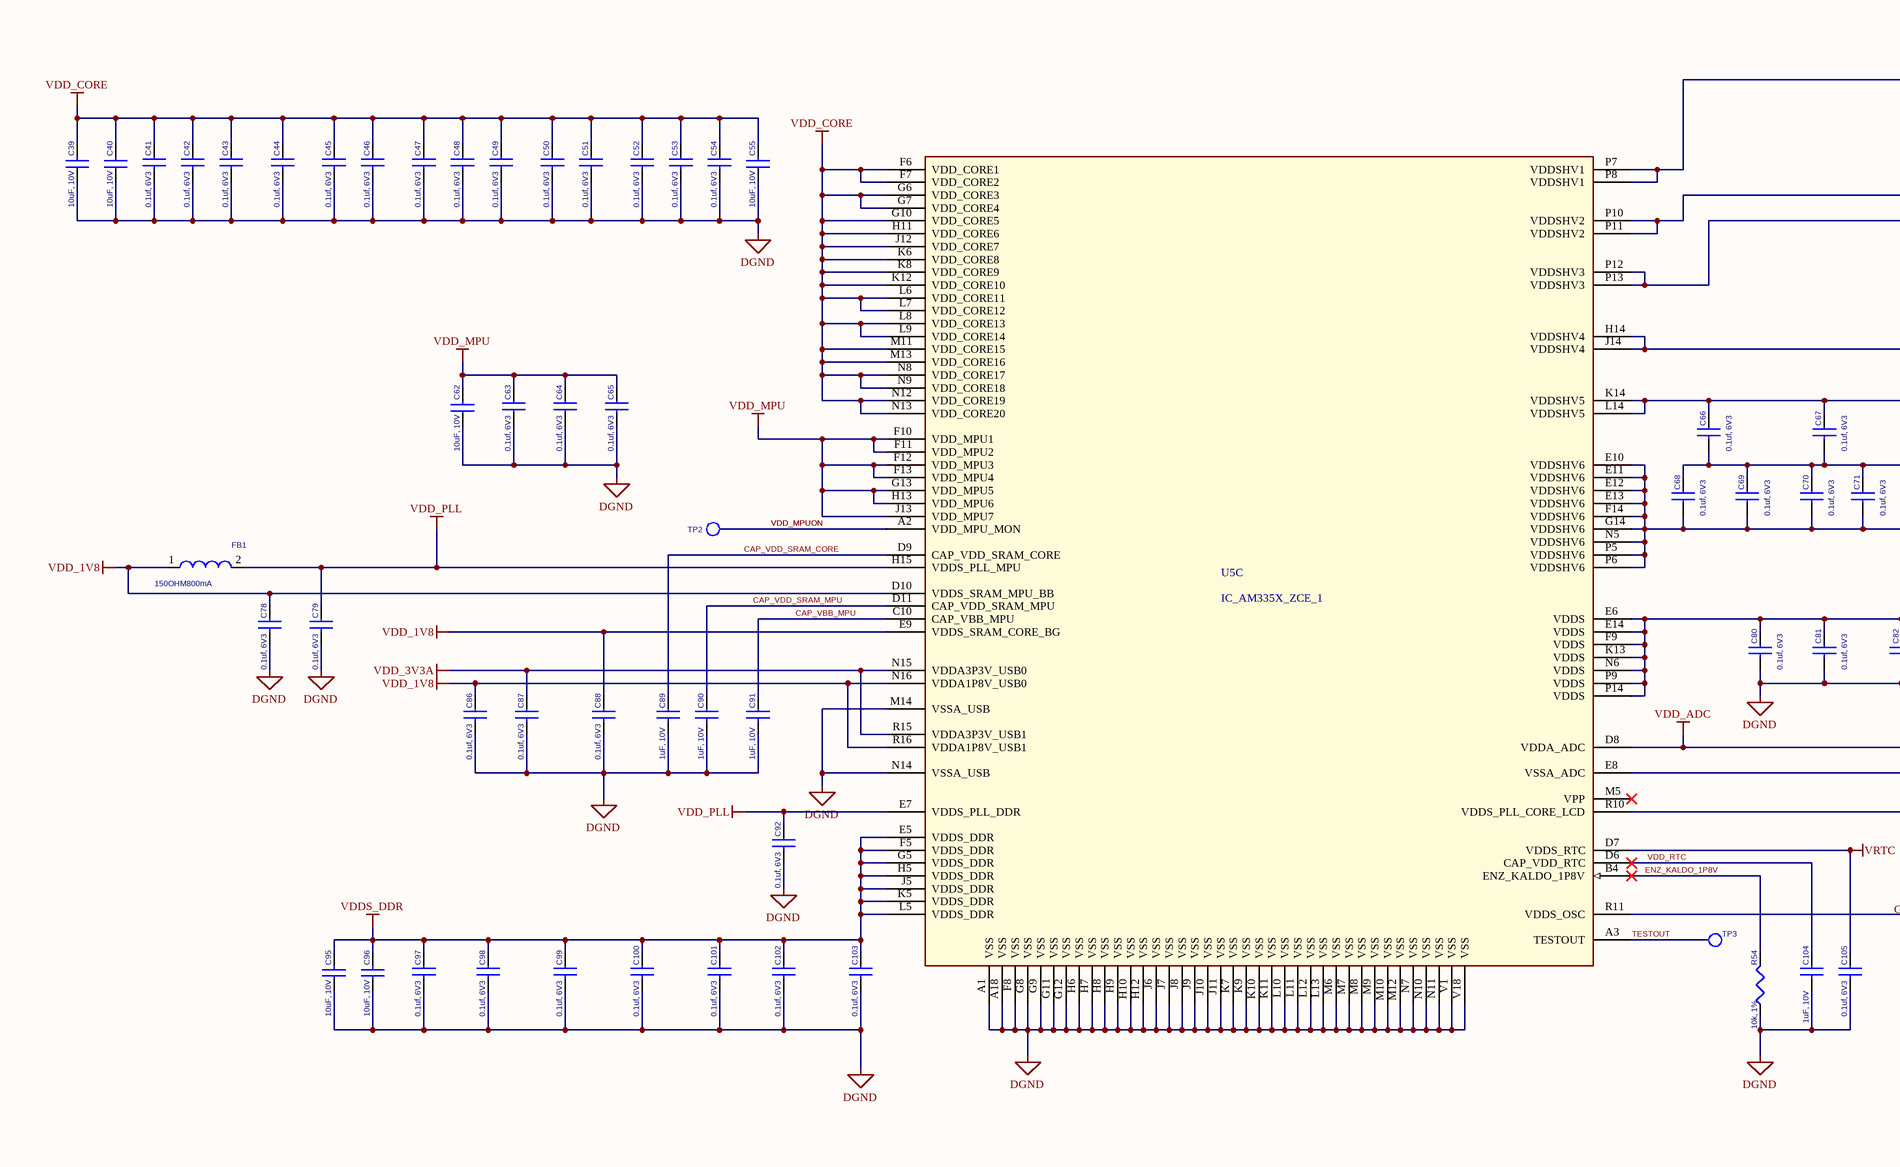
[diagram p5: P05_Processor Page 3 of 3.SchDoc, left]
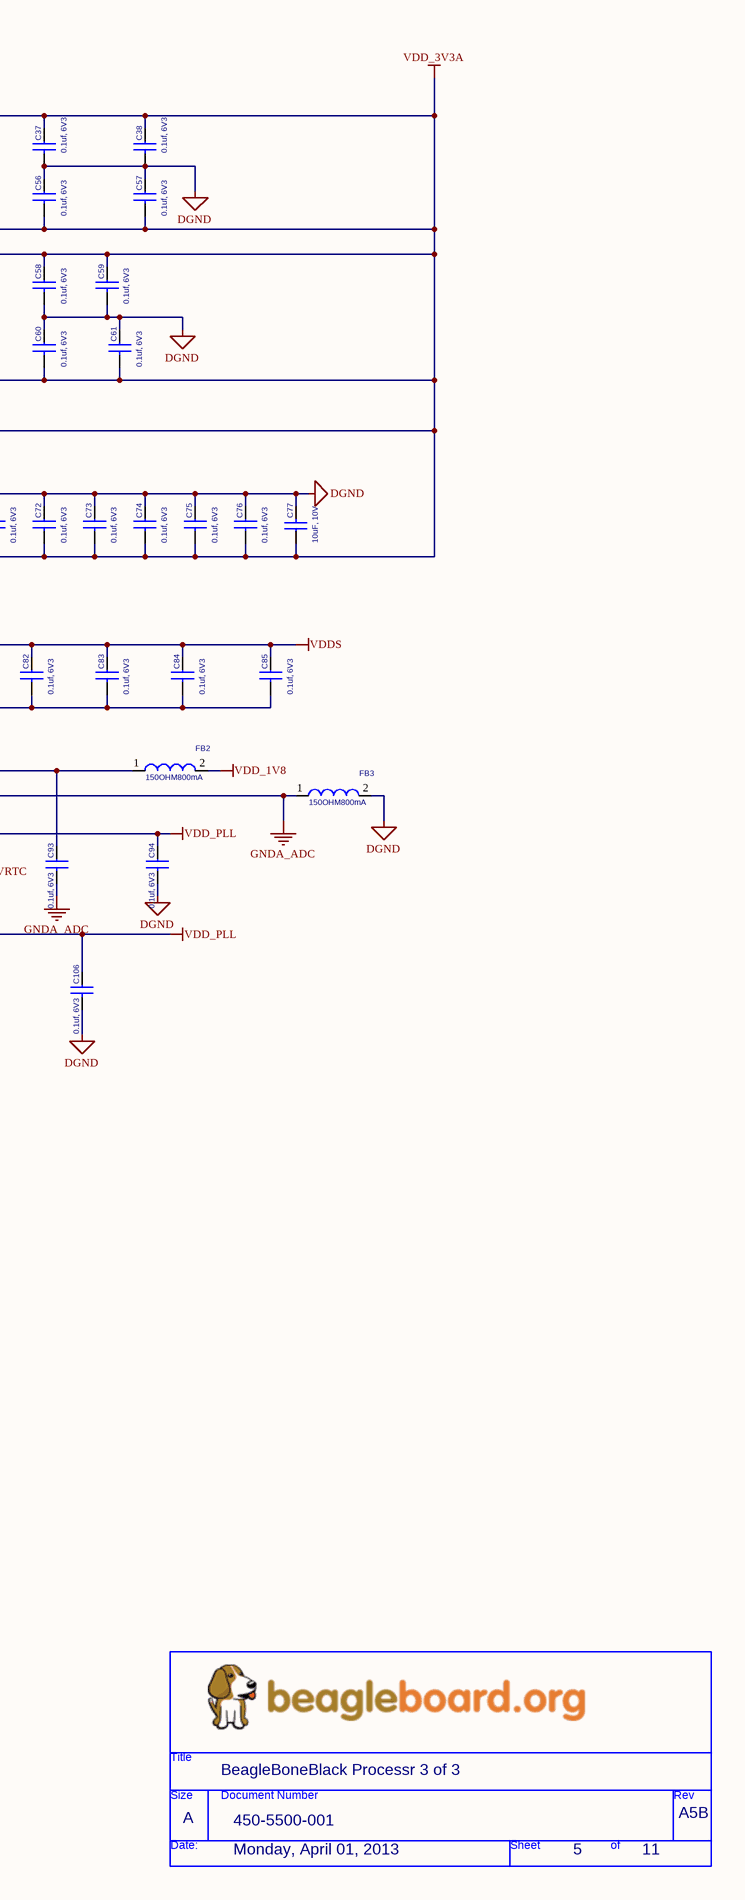
[diagram p6: P05_Processor Page 3 of 3.SchDoc, right]

### Parts
(Parts that share a designator on the sheet are numbered #1, #2 ... from top to bottom, then left to right.)
*#5  Page Create Date: Monday, April 01, 2013  Doc: 450-5500-001  RevCode: A5B  Title: BeagleBoneBlack Processr 3 of 3  Page Size: A  Page Number: 5  Page Count: 11  (hidden comment: BeagleBoard_org)  (graphical)
C37  0.1uf, 6V3  [402]
C38  0.1uf, 6V3  [402]
C39  10uF, 10V  [805]
C40  10uF, 10V  [805]
C41  0.1uf, 6V3  [402]
C42  0.1uf, 6V3  [402]
C43  0.1uf, 6V3  [402]
C44  0.1uf, 6V3  [402]
C45  0.1uf, 6V3  [402]
C46  0.1uf, 6V3  [402]
C47  0.1uf, 6V3  [402]
C48  0.1uf, 6V3  [402]
C49  0.1uf, 6V3  [402]
C50  0.1uf, 6V3  [402]
C51  0.1uf, 6V3  [402]
C52  0.1uf, 6V3  [402]
C53  0.1uf, 6V3  [402]
C54  0.1uf, 6V3  [402]
C55  10uF, 10V  [805]
C56  0.1uf, 6V3  [402]
C57  0.1uf, 6V3  [402]
C58  0.1uf, 6V3  [402]
C59  0.1uf, 6V3  [402]
C60  0.1uf, 6V3  [402]
C61  0.1uf, 6V3  [402]
C62  10uF, 10V  [805]
C63  0.1uf, 6V3  [402]
C64  0.1uf, 6V3  [402]
C65  0.1uf, 6V3  [402]
C66  0.1uf, 6V3  [402]
C67  0.1uf, 6V3  [402]
C68  0.1uf, 6V3  [402]
C69  0.1uf, 6V3  [402]
C70  0.1uf, 6V3  [402]
C71  0.1uf, 6V3  [402]
C72  0.1uf, 6V3  [402]
C73  0.1uf, 6V3  [402]
C74  0.1uf, 6V3  [402]
C75  0.1uf, 6V3  [402]
C76  0.1uf, 6V3  [402]
C77  10uF, 10V  [805]
C78  0.1uf, 6V3  [402]
C79  0.1uf, 6V3  [402]
C80  0.1uf, 6V3  [402]
C81  0.1uf, 6V3  [402]
C82  0.1uf, 6V3  [402]
C83  0.1uf, 6V3  [402]
C84  0.1uf, 6V3  [402]
C85  0.1uf, 6V3  [402]
C86  0.1uf, 6V3  [402]
C87  0.1uf, 6V3  [402]
C88  0.1uf, 6V3  [402]
C89  1uF, 10V  [402]
C90  1uF, 10V  [402]
C91  1uF, 10V  [402]
C92  0.1uf, 6V3  [402]
C93  0.1uf, 6V3  [402]
C94  0.1uf, 6V3  [402]
C95  10uF, 10V  [805]
C96  10uF, 10V  [805]
C97  0.1uf, 6V3  [402]
C98  0.1uf, 6V3  [402]
C99  0.1uf, 6V3  [402]
C100  0.1uf, 6V3  [402]
C101  0.1uf, 6V3  [402]
C102  0.1uf, 6V3  [402]
C103  0.1uf, 6V3  [402]
C104  1uF, 10V  [402]
C105  0.1uf, 6V3  [402]
C106  0.1uf, 6V3  [402]
FB1  150OHM800mA  [SM-7351-IND-0805]
FB2  150OHM800mA  [SM-7351-IND-0805]
FB3  150OHM800mA  [SM-7351-IND-0805]
R54  10k, 1%  [402]
TP2  TESTPT1  [TP60C_SMD]  (value not drawn)  (no BOM)
TP3  TESTPT1  [TP60C_SMD]  (value not drawn)  (no BOM)
U5  IC_AM335X_ZCE_1  [am33xx_15x15]  (part C of 3)

### Nets
DGND: C37.2 C38.2 C39.1 C40.1 C41.2 C42.2 C43.2 C44.2 C45.2 C46.2 C47.2 C48.2 C49.2 C50.2 C51.2 C52.2 C53.2 C54.2 C55.1 C56.1 C57.1 C58.2 C59.2 C60.1 C61.1 C62.1 C63.2 C64.2 C65.2 C66.2 C67.2 C68.1 C69.1 C70.1 C71.1 C72.1 C73.1 C74.1 C75.1 C76.1 C77.2 C78.2 C79.2 C80.2 C81.2 C82.2 C83.2 C84.2 C85.2 C86.2 C87.2 C88.2 C89.2 C90.2 C91.2 C92.2 C94.2 C95.1 C96.1 C97.2 C98.2 C99.2 C100.2 C101.2 C102.2 C103.2 C104.2 C105.2 C106.2 FB3.2 R54.1 U5.A1(VSS) U5.A18(VSS) U5.F8(VSS) U5.G8(VSS) U5.G9(VSS) U5.G11(VSS) U5.G12(VSS) U5.H6(VSS) U5.H7(VSS) U5.H8(VSS) U5.H9(VSS) U5.H10(VSS) U5.H12(VSS) U5.J6(VSS) U5.J7(VSS) U5.J8(VSS) U5.J9(VSS) U5.J10(VSS) U5.J11(VSS) U5.K7(VSS) U5.K9(VSS) U5.K10(VSS) U5.K11(VSS) U5.L10(VSS) U5.L11(VSS) U5.L12(VSS) U5.L13(VSS) U5.M6(VSS) U5.M7(VSS) U5.M8(VSS) U5.M9(VSS) U5.M10(VSS) U5.M12(VSS) U5.M14(VSSA_USB) U5.N7(VSS) U5.N10(VSS) U5.N11(VSS) U5.N14(VSSA_USB) U5.V1(VSS) U5.V18(VSS)
GNDA_ADC: C93.2 FB3.1 U5.E8(VSSA_ADC)
VDD_1V8: C78.1 C86.1 C88.1 FB1.1 FB2.2 U5.D10(VDDS_SRAM_MPU_BB) U5.E9(VDDS_SRAM_CORE_BG) U5.N16(VDDA1P8V_USB0) U5.R16(VDDA1P8V_USB1)
VDD_3V3A: C37.1 C38.1 C56.2 C57.2 C58.1 C59.1 C60.2 C61.2 C66.1 C67.1 C68.2 C69.2 C70.2 C71.2 C72.2 C73.2 C74.2 C75.2 C76.2 C77.1 C87.1 U5.E10(VDDSHV6) U5.E11(VDDSHV6) U5.E12(VDDSHV6) U5.E13(VDDSHV6) U5.F14(VDDSHV6) U5.G14(VDDSHV6) U5.H14(VDDSHV4) U5.J14(VDDSHV4) U5.K14(VDDSHV5) U5.L14(VDDSHV5) U5.N5(VDDSHV6) U5.N15(VDDA3P3V_USB0) U5.P5(VDDSHV6) U5.P6(VDDSHV6) U5.P7(VDDSHV1) U5.P8(VDDSHV1) U5.P10(VDDSHV2) U5.P11(VDDSHV2) U5.P12(VDDSHV3) U5.P13(VDDSHV3) U5.R15(VDDA3P3V_USB1)
VDD_ADC: C93.1 FB2.1 U5.D8(VDDA_ADC)
VDD_CORE: C39.2 C40.2 C41.1 C42.1 C43.1 C44.1 C45.1 C46.1 C47.1 C48.1 C49.1 C50.1 C51.1 C52.1 C53.1 C54.1 C55.2 U5.F6(VDD_CORE1) U5.F7(VDD_CORE2) U5.G6(VDD_CORE3) U5.G7(VDD_CORE4) U5.G10(VDD_CORE5) U5.H11(VDD_CORE6) U5.J12(VDD_CORE7) U5.K6(VDD_CORE8) U5.K8(VDD_CORE9) U5.K12(VDD_CORE10) U5.L6(VDD_CORE11) U5.L7(VDD_CORE12) U5.L8(VDD_CORE13) U5.L9(VDD_CORE14) U5.M11(VDD_CORE15) U5.M13(VDD_CORE16) U5.N8(VDD_CORE17) U5.N9(VDD_CORE18) U5.N12(VDD_CORE19) U5.N13(VDD_CORE20)
VDD_MPU: C62.2 C63.1 C64.1 C65.1 U5.F10(VDD_MPU1) U5.F11(VDD_MPU2) U5.F12(VDD_MPU3) U5.F13(VDD_MPU4) U5.G13(VDD_MPU5) U5.H13(VDD_MPU6) U5.J13(VDD_MPU7)
VDD_PLL: C79.1 C92.1 C94.1 C106.1 FB1.2 U5.E7(VDDS_PLL_DDR) U5.H15(VDDS_PLL_MPU) U5.R10(VDDS_PLL_CORE_LCD) U5.R11(VDDS_OSC)
VDDS: C80.1 C81.1 C82.1 C83.1 C84.1 C85.1 U5.E6(VDDS) U5.E14(VDDS) U5.F9(VDDS) U5.K13(VDDS) U5.N6(VDDS) U5.P9(VDDS) U5.P14(VDDS)
VDDS_DDR: C95.2 C96.2 C97.1 C98.1 C99.1 C100.1 C101.1 C102.1 C103.1 U5.E5(VDDS_DDR) U5.F5(VDDS_DDR) U5.G5(VDDS_DDR) U5.H5(VDDS_DDR) U5.J5(VDDS_DDR) U5.K5(VDDS_DDR) U5.L5(VDDS_DDR)
VRTC: C105.1 U5.D7(VDDS_RTC)
CAP_VBB_MPU: C91.1 U5.C10(CAP_VBB_MPU)
CAP_VDD_SRAM_CORE: C89.1 U5.D9(CAP_VDD_SRAM_CORE)
CAP_VDD_SRAM_MPU: C90.1 U5.D11(CAP_VDD_SRAM_MPU)
ENZ_KALDO_1P8V: R54.2 U5.B4(ENZ_KALDO_1P8V)
TESTOUT: TP3.1(TP) U5.A3(TESTOUT)
VDD_MPUON: TP2.1(TP) U5.A2(VDD_MPU_MON)
VDD_RTC: C104.1 U5.D6(CAP_VDD_RTC)

Not connected (* = marked no-connect by the designer): U5 M5(VPP)*

### Notes on the sheet
- (in symbol BeagleBoard_org) Title; Size; Document Number; Rev; Date:; Sheet; of

### Library data of the parts
C37 C38 C41-C54 C56-C61 C63-C76 C78-C88 C92-C94 C97-C103 C105 C106 = CAP_0.1uF_X7R_16V_10% 0402: as C31 on sheet P04_Processor 2 or 3, USB and Serial; Supplier 1: Digi-Key; Supplier Part Number 1: 445-1266-6-ND; RoHS: RoHS Compliant; Category: Capacitors; Stock 1: 127604; Pricing 1: 1=0.1, 10=0.026, 100=0.0121, 250=0.00992, 500=0.00848, 1000=0.0066, 5000=0.0055 (USD); Voltage - Rated: 6.3V; Tolerance: ±10%; Temperature Coefficient: X5R; Mounting Type: Surface Mount, MLCC; Operating Temperature: -55°C ~ 85°C; Applications: General Purpose; Ratings: -; Package / Case: 0402 (1005 Metric); Size / Dimension: 0.039" L x 0.020" W (1.00mm x 0.50mm); Height - Seated (Max): -; Thickness (Max): 0.022" (0.55mm); Lead Spacing: -; Features: -; Packaging: Digi-Reel®; Lead Style: -; ComponentLink1URL: http://www.kemet.com/datasheets&C0402C104K4RACTU; ComponentLink1Description: http://www.kemet.com/datasheets&C0402C104K4RACTU
C39 C55 C62 C77 C95 C96 = CAP_10uF_Y5V_10V_10%_0805: CAP CER 10UF 10V Y5V 0805; Manufacturer: TDK Corporation; Manufacturer Part Number: C2012Y5V1A106Z; Capacitance: 10µF; Tolerance: -20%, +80%; Temperature Coefficient: Y5V (F); Supplier 1: Digi-Key; Supplier Part Number 1: 445-1371-6-ND; RoHS: RoHS Compliant; Category: Capacitors; Stock 1: 111942; Pricing 1: 1=0.15, 10=0.105, 100=0.0499, 250=0.042, 500=0.03518, 1000=0.02887 (USD); Voltage - Rated: 10V; Mounting Type: Surface Mount, MLCC; Operating Temperature: -30°C ~ 85°C; Applications: General Purpose; Ratings: -; Package / Case: 0805 (2012 Metric); Size / Dimension: 0.079" L x 0.049" W (2.00mm x 1.25mm); Height - Seated (Max): -; Thickness (Max): 0.057" (1.45mm); Lead Spacing: -; Features: -; Packaging: Digi-Reel®; Lead Style: -; ComponentLink1URL: http://media.digikey.com/pdf/Data%20Sheets/TDK%20PDFs/C_Series_GeneralAppl_B11.pdf; ComponentLink1Description: http://media.digikey.com/pdf/Data%20Sheets/TDK%20PDFs/C_Series_GeneralAppl_B11.pdf
C40 = CAP_10uF_Y5V_10V_10%_0805: CAP CER 10UF 10V Y5V 0805; Manufacturer: TDK Corporation; Manufacturer Part Number: C2012Y5V1A106Z; Capacitance: 10µF; Temperature Coefficient: Y5V (F); Tolerance: -20%, +80%; Applications: General Purpose; Category: Capacitors; ComponentLink1Description: http://media.digikey.com/pdf/Data%20Sheets/TDK%20PDFs/C_Series_GeneralAppl_B11.pdf; ComponentLink1URL: http://media.digikey.com/pdf/Data%20Sheets/TDK%20PDFs/C_Series_GeneralAppl_B11.pdf; Features: -; Height - Seated (Max): -; Lead Spacing: -; Lead Style: -; Mounting Type: Surface Mount, MLCC; Operating Temperature: -30°C ~ 85°C; Package / Case: 0805 (2012 Metric); Packaging: Digi-Reel®; Pricing 1: 1=0.15, 10=0.105, 100=0.0499, 250=0.042, 500=0.03518, 1000=0.02887 (USD); Ratings: -; RoHS: RoHS Compliant; Size / Dimension: 0.079" L x 0.049" W (2.00mm x 1.25mm); Stock 1: 111942; Supplier 1: Digi-Key; Supplier Part Number 1: 445-1371-6-ND; Thickness (Max): 0.057" (1.45mm); Voltage - Rated: 10V
C89-C91 C104 = CAP_1.0UF_X5R_10V_10%_0402: CAP CER 1UF 10V 10% X5R 0402; Manufacturer: AVX Corporation; Manufacturer Part Number: 0402ZD105KAT2A; Capacitance: 1.0µF; Supplier 1: Digi-Key; Supplier Part Number 1: 478-4596-6-ND; RoHS: RoHS Compliant; Category: Capacitors; Stock 1: 409277; Pricing 1: 1=0.3, 10=0.25, 100=0.125, 250=0.09376, 500=0.08282, 1000=0.07344, 5000=0.06094 (USD); Voltage - Rated: 10V; Tolerance: ±10%; Temperature Coefficient: X5R; Mounting Type: Surface Mount, MLCC; Operating Temperature: -55°C ~ 85°C; Applications: General Purpose; Ratings: -; Package / Case: 0402 (1005 Metric); Size / Dimension: 0.039" L x 0.020" W (1.00mm x 0.50mm); Height - Seated (Max): -; Thickness (Max): 0.022" (0.56mm); Lead Spacing: -; Features: -; Packaging: Digi-Reel®; Lead Style: -; ComponentLink1URL: http://www.avx.com/docs/Catalogs/cx5r.pdf; ComponentLink1Description: http://www.avx.com/docs/Catalogs/cx5r.pdf
FB1-FB3 = FER_180_200_0: as FB7 on sheet P04_Processor 2 or 3, USB and Serial; Supplier 1: Digi-Key; Supplier Part Number 1: 240-2384-6-ND; Manufacturer Part Number: LI0805H151R-10; RoHS: RoHS Compliant; Category: Filters; Stock 1: 3694; Pricing 1: 1=0.1, 10=0.07, 25=0.064, 50=0.0574, 100=0.0421, 250=0.03064, 500=0.02808, 1000=0.02424 (USD); Current Rating: 800mA; Package / Case: 0805 (2012 Metric); Mounting Type: Surface Mount; Packaging: Digi-Reel®; Height (Max): 0.043" (1.10mm); Size / Dimension: 0.079" L x 0.049" W (2.00mm x 1.25mm); ComponentLink1URL: http://www.lairdtech.com/WorkArea/linkit.aspx?LinkIdentifier=id&ItemID=4912; ComponentLink1Description: http://www.lairdtech.com/WorkArea/linkit.aspx?LinkIdentifier=id&ItemID=4912
R54 = RES_10K_1/16W_1%_0402: RES 10K OHM 1/16W 5% 0402 SMD; Manufacturer: Rohm Semiconductor; Manufacturer Part Number: MCR01MZPJ103; Power (Watts): 0.063W, 1/16W; Temperature Coefficient: ±200ppm/°C; Supplier 1: Digi-Key; Supplier Part Number 1: RHM10KJDKR-ND; RoHS: RoHS Compliant; Category: Resistors; Stock 1: 110842; Pricing 1: 1=0.1, 10=0.019, 25=0.014, 100=0.0078, 250=0.00596, 500=0.00476, 1000=0.0035, 5000=0.00251 (USD); Resistance (Ohms): 10k; Composition: Thick Film; Features: Automotive AEC-Q200 Qualified; Tolerance: ±5%; Package / Case: 0402 (1005 Metric); Supplier Device Package: 0402 (1005 Metric); Size / Dimension: 0.039" L x 0.020" W (1.00mm x 0.50mm); Height: 0.016" (0.40mm); Number of Terminations: 2; Packaging: Digi-Reel®; ComponentLink1URL: http://rohmfs.rohm.com/en/products/databook/datasheet/passive/resistor/chip_resistor/mcr_a.pdf; ComponentLink1Description: http://rohmfs.rohm.com/en/products/databook/datasheet/passive/resistor/chip_resistor/mcr_a.pdf
U5 = IC_AM335X_ZCE_1: as U5 on sheet P04_Processor 2 or 3, USB and Serial; Cost10K: 10.00; Part Number: IC_AM335x_ZCE; Supplier 1: Digi-Key; Supplier Part Number 1: 296-35073-ND; RoHS: RoHS Compliant; Category: Integrated Circuits (ICs); Stock 1: 16; Pricing 1: 1=33.5, 10=30.988, 100=26.465, 250=24.28752, 500=23.115, 1000=21.775, 2500=21.105, 5000=20.6025, 10000=20.1 (USD); Features: -; Speed: -; Mounting Type: Surface Mount; Package / Case: 324-LFBGA; Supplier Device Package: 324-NFBGA(15x15); Packaging: Tray; ComponentLink1URL: http://www.ti.com/lit/ds/symlink/am3354.pdf; ComponentLink1Description: http://www.ti.com/lit/ds/symlink/am3354.pdf

## Sheet P06_LED, Config, & Button.SchDoc
size 386 x 246 mm
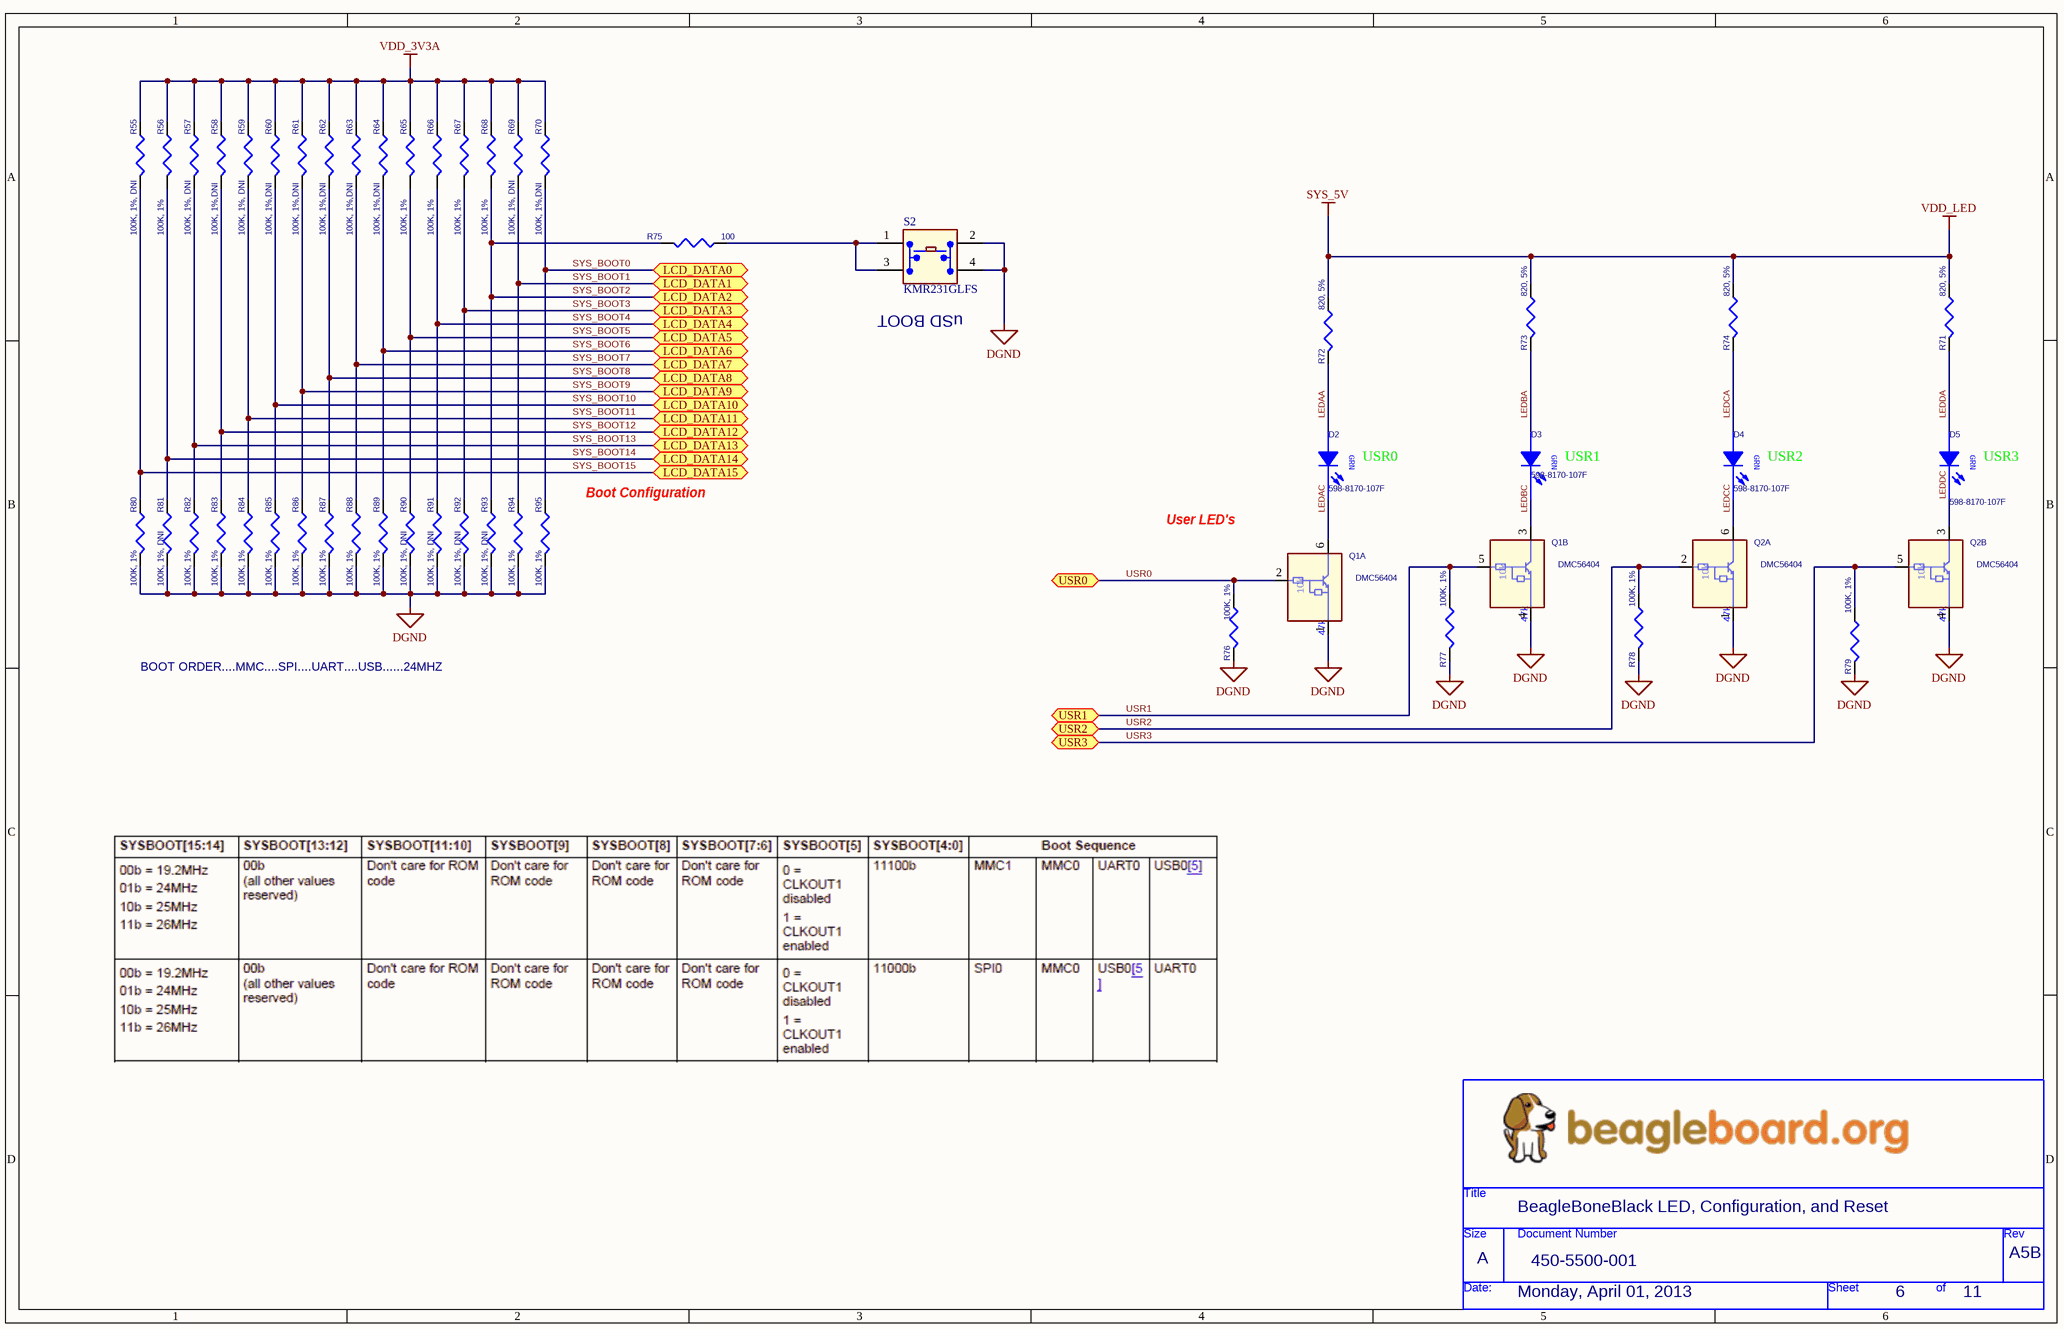
[diagram p7: P06_LED, Config, & Button.SchDoc]

### Parts
(Parts that share a designator on the sheet are numbered #1, #2 ... from top to bottom, then left to right.)
*#6  Page Create Date: Monday, April 01, 2013  Doc: 450-5500-001  RevCode: A5B  Title: BeagleBoneBlack LED, Configuration, and Reset  Page Size: A  Page Number: 6  Page Count: 11  (hidden comment: BeagleBoard_org)  (graphical)
D2  598-8170-107F  [LED_0603]
D3  598-8170-107F  [LED_0603]
D4  598-8170-107F  [LED_0603]
D5  598-8170-107F  [LED_0603]
Q1  DMC56404  [SMini6-F3-B]  (parts A,B of 2)
Q2  DMC56404  [SMini6-F3-B]  (parts A,B of 2)
R55  100K, 1%, DNI  [402]
R56  100K, 1%  [402]
R57  100K, 1%, DNI  [402]
R58  100K, 1%,DNI  [402]
R59  100K, 1%, DNI  [402]
R60  100K, 1%,DNI  [402]
R61  100K, 1%,DNI  [402]
R62  100K, 1%,DNI  [402]
R63  100K, 1%,DNI  [402]
R64  100K, 1%,DNI  [402]
R65  100K, 1%  [402]
R66  100K, 1%  [402]
R67  100K, 1%  [402]
R68  100K, 1%  [402]
R69  100K, 1%, DNI  [402]
R70  100K, 1%,DNI  [402]
R71  820, 5%  [402]
R72  820, 5%  [402]
R73  820, 5%  [402]
R74  820, 5%  [402]
R75  100  [402]
R76  100K, 1%  [402]
R77  100K, 1%  [402]
R78  100K, 1%  [402]
R79  100K, 1%  [402]
R80  100K, 1%  [402]
R81  100K, 1%, DNI  [402]
R82  100K, 1%  [402]
R83  100K, 1%  [402]
R84  100K, 1%  [402]
R85  100K, 1%  [402]
R86  100K, 1%  [402]
R87  100K, 1%  [402]
R88  100K, 1%  [402]
R89  100K, 1%  [402]
R90  100K, 1%, DNI  [402]
R91  100K, 1%, DNI  [402]
R92  100K, 1%, DNI  [402]
R93  100K, 1%, DNI  [402]
R94  100K, 1%  [402]
R95  100K, 1%  [402]
S2  KMR231GLFS  [SW4SMD_63X161LS]

### Ports
LCD_DATA0, LCD_DATA1, LCD_DATA2, LCD_DATA3, LCD_DATA4, LCD_DATA5, LCD_DATA6, LCD_DATA7, LCD_DATA8, LCD_DATA9, LCD_DATA10, LCD_DATA11, LCD_DATA12, LCD_DATA13, LCD_DATA14, LCD_DATA15, USR0, USR1, USR2, USR3

### Nets
DGND: Q1.1 Q1.4 Q2.1 Q2.4 R76.2 R77.2 R78.2 R79.2 R80.2 R81.2 R82.2 R83.2 R84.2 R85.2 R86.2 R87.2 R88.2 R89.2 R90.2 R91.2 R92.2 R93.2 R94.2 R95.2 S2.2(A2) S2.4
SYS_5V: R71.1 R72.1 R73.1 R74.1  [also labelled VDD_LED]
VDD_3V3A: R55.1 R56.1 R57.1 R58.1 R59.1 R60.1 R61.1 R62.1 R63.1 R64.1 R65.1 R66.1 R67.1 R68.1 R69.1 R70.1
LEDAA: D2.2(A) R72.2
LEDAC: D2.1(C) Q1.6
LEDBA: D3.2(A) R73.2
LEDBC: D3.1(C) Q1.3
LEDCA: D4.2(A) R74.2
LEDCC: D4.1(C) Q2.6
LEDDA: D5.2(A) R71.2
LEDDC: D5.1(C) Q2.3
SYS_BOOT0: R70.2 R95.1 ; port LCD_DATA0  [project net LCD_DATA0]
SYS_BOOT1: R69.2 R94.1 ; port LCD_DATA1  [project net LCD_DATA1]
SYS_BOOT2: R68.2 R75.1(P1) R93.1 ; port LCD_DATA2  [project net LCD_DATA2]
SYS_BOOT3: R67.2 R92.1 ; port LCD_DATA3  [project net LCD_DATA3]
SYS_BOOT4: R66.2 R91.1 ; port LCD_DATA4  [project net LCD_DATA4]
SYS_BOOT5: R65.2 R90.1 ; port LCD_DATA5  [project net LCD_DATA5]
SYS_BOOT6: R64.2 R89.1 ; port LCD_DATA6  [project net LCD_DATA6]
SYS_BOOT7: R63.2 R88.1 ; port LCD_DATA7  [project net LCD_DATA7]
SYS_BOOT8: R62.2 R87.1 ; port LCD_DATA8  [project net LCD_DATA8]
SYS_BOOT9: R61.2 R86.1 ; port LCD_DATA9  [project net LCD_DATA9]
SYS_BOOT10: R60.2 R85.1 ; port LCD_DATA10  [project net LCD_DATA10]
SYS_BOOT11: R59.2 R84.1 ; port LCD_DATA11  [project net LCD_DATA11]
SYS_BOOT12: R58.2 R83.1 ; port LCD_DATA12  [project net LCD_DATA12]
SYS_BOOT13: R57.2 R82.1 ; port LCD_DATA13  [project net LCD_DATA13]
SYS_BOOT14: R56.2 R81.1 ; port LCD_DATA14  [project net LCD_DATA14]
SYS_BOOT15: R55.2 R80.1 ; port LCD_DATA15  [project net LCD_DATA15]
USR0: Q1.2 R76.1 ; port USR0
USR1: Q1.5 R77.1 ; port USR1
USR2: Q2.2 R78.1 ; port USR2
USR3: Q2.5 R79.1 ; port USR3
NetR75_2: R75.2(P2) S2.1(A1) S2.3(A3)

### Notes on the sheet
- (near S2) uSD BOOT
- (near D2) USR0
- (near D3) USR1
- (near D4) USR2
- (near D5) USR3
- (near R95) Boot Configuration
- User LED's
- BOOT ORDER....MMC....SPI....UART....USB......24MHZ
- (in symbol BeagleBoard_org) Title; Size; Document Number; Rev; Date:; Sheet; of
- (in symbol LED_LTST-C150GKT) GRN

### Library data of the parts
D2-D5 = LED_LTST-C150GKT: LED GREEN CLEAR 0805 SMD; Manufacturer: Lite-On Inc; Manufacturer Part Number: LTST-C170KGKT; CLASS: DISCRETE; TN: 257-0020-000; Current - Test: 20mA; Lens Style/Size: Rectangle with Flat Top, 1.4mm x 1.25mm; Millicandela Rating: 35mcd; Viewing Angle: 130°; Voltage - Forward (Vf) Typ: 2V; Wavelength - Dominant: 571nm; Wavelength - Peak: 574nm; Category: Optoelectronics; Color: Green; ComponentLink1Description: http://optoelectronics.liteon.com/en-us/api/DwonloadFileHandler.ashx?txtSpecNo=DS22-2000-073&txtPartNo=LTST-C170KGKT; ComponentLink1URL: http://optoelectronics.liteon.com/en-us/api/DwonloadFileHandler.ashx?txtSpecNo=DS22-2000-073&txtPartNo=LTST-C170KGKT; Height: 1.10mm; Lens Type: Clear; Luminous Flux @ Current - Test: -; Mounting Type: Surface Mount; Package / Case: 0805 (2012 Metric); Packaging: Digi-Reel®; Pricing 1: 1=0.37, 10=0.267, 100=0.1574, 250=0.11136, 500=0.09504, 1000=0.07425 (USD); RoHS: RoHS Compliant; Size / Dimension: 2.00mm L x 1.25mm W; Stock 1: 274890; Supplier 1: Digi-Key; Supplier Part Number 1: 160-1414-6-ND
Q1 Q2 = RN1907: TRANS PREBIASED DUAL NPN SOT363; Manufacturer: Toshiba; Manufacturer Part Number: DDC114YU-7-F; Order# 2: BCR135S; ATLStockNo1: 2130.0137; ATLStockNo2: 2130.01; Transistor Type: 2 NPN - Pre-Biased (Dual); Current - Collector (Ic) (Max): 100mA; Voltage - Collector Emitter Breakdown (Max): 50V; Resistor - Base (R1) (Ohms): 10k; Resistor - Emitter Base (R2) (Ohms): 47k; DC Current Gain (hFE) (Min) @ Ic, Vce: 68 @ 10mA, 5V; Vce Saturation (Max) @ Ib, Ic: 300mV @ 250µA, 5mA; Current - Collector Cutoff (Max): 500nA; Frequency - Transition: 250MHz; Power - Max: 200mW; Supplier 1: Digi-Key; Supplier Part Number 1: DDC114YU-FDIDKR-ND; RoHS: RoHS Compliant; Category: Discrete Semiconductor Products; Stock 1: 11411; Pricing 1: 1=0.46, 10=0.334, 25=0.2596, 100=0.1966, 250=0.13896, 500=0.11124, 1000=0.08532 (USD); Mounting Type: Surface Mount; Package / Case: 6-TSSOP, SC-88, SOT-363; Supplier Device Package: SOT-363; Packaging: Digi-Reel®; ComponentLink1URL: http://www.diodes.com/datasheets/ds30345.pdf; ComponentLink1Description: http://www.diodes.com/datasheets/ds30345.pdf
R55-R70 R76-R95 = RES_100K_1/16W_1%_0402: RES 100K OHM 1/16W 1% 0402 SMD; Manufacturer: Stackpole Electronics Inc; Manufacturer Part Number: RMCF0402FT100K; Power (Watts): 0.063W, 1/16W; Temperature Coefficient: ±100ppm/°C; Category: Resistors; ComponentLink1Description: http://www.seielect.com/Catalog/SEI-RMCF_RMCP.pdf; ComponentLink1URL: http://www.seielect.com/Catalog/SEI-RMCF_RMCP.pdf; Composition: Thick Film; Features: -; Height: 0.016" (0.40mm); Number of Terminations: 2; Package / Case: 0402 (1005 Metric); Packaging: Digi-Reel®; Pricing 1: 1=0.04, 10=0.025, 50=0.0138, 100=0.0105, 250=0.0078, 500=0.00576, 1000=0.00384, 2500=0.00324, 5000=0.0027 (USD); Resistance (Ohms): 100k; RoHS: RoHS Compliant; Size / Dimension: 0.039" L x 0.020" W (1.00mm x 0.50mm); Stock 1: 851196; Supplier 1: Digi-Key; Supplier Device Package: 0402; Supplier Part Number 1: RMCF0402FT100KDKR-ND; Tolerance: ±1%
R71-R74 = RES_470_1/10W_5%_0402: RES 820 OHM 1/10W 5% 0402 SMD; Manufacturer: Yageo; Manufacturer Part Number: RC0402JR-07820RL; Power (Watts): 0.063W, 1/16W; Resistance (Ohms): 820; Temperature Coefficient: ±100ppm/°C; Category: Resistors; ComponentLink1Description: http://www.yageo.com/documents/recent/PYu-RC0402_51_RoHS_L_6.pdf; ComponentLink1URL: http://www.yageo.com/documents/recent/PYu-RC0402_51_RoHS_L_6.pdf; Composition: Thick Film; Features: -; Height: 0.016" (0.40mm); Number of Terminations: 2; Package / Case: 0402 (1005 Metric); Packaging: Digi-Reel®; Pricing 1: 1=0.1, 10=0.012, 25=0.0092, 100=0.0055, 250=0.00476, 500=0.00336, 1000=0.00237, 2500=0.00206, 5000=0.00178 (USD); RoHS: RoHS Compliant; Size / Dimension: 0.039" L x 0.020" W (1.00mm x 0.50mm); Stock 1: 7437; Supplier 1: Digi-Key; Supplier Device Package: 0402; Supplier Part Number 1: 311-820JRDKR-ND; Tolerance: ±5%
R75 = RES SMD: RES 100 OHM 1/10W 5% 0402 SMD; Manufacturer: Panasonic Electronic Components; Manufacturer Part Number: ERJ-2RKF1000X; Power (Watts): 0.1W, 1/10W; Temperature Coefficient: ±100ppm/°C; Category: Resistors; ComponentLink1Description: http://industrial.panasonic.com/www-cgi/jvcr13pz.cgi?E+PZ+3+AOA0002+ERJ2RKF1000X+7+WW; ComponentLink1URL: http://industrial.panasonic.com/www-cgi/jvcr13pz.cgi?E+PZ+3+AOA0002+ERJ2RKF1000X+7+WW; Composition: Thick Film; Features: -; Height: 0.016" (0.40mm); Number of Terminations: 2; Package / Case: 0402 (1005 Metric); Packaging: Digi-Reel®; Pricing 1: 1=0.1, 50=0.0242, 100=0.0184, 250=0.01364, 500=0.01008, 1000=0.00672, 5000=0.00473 (USD); Resistance (Ohms): 100; RoHS: RoHS; Size / Dimension: 0.039" L x 0.020" W (1.00mm x 0.50mm); Stock 1: 2375521; Supplier 1: Digi-Key; Supplier Device Package: 0402; Supplier Part Number 1: P100LDKR-ND
S2 = KMR2: Microminiature Tact Switch for SMT; Manufacturer: C&K Components; Circuit: SPST-NO; Switch Function: Off-Mom; Contact Rating @ Voltage: 0.05A @ 32VDC; Actuator Type: Standard; Actuator Height off PCB, from Pins: 1.90mm; Actuator Orientation: Top Actuated; Outline: 4.60mm x 2.80mm; Illumination: Non-Illuminated; Operating Force: 300gf; Switch Travel: 0.25mm; Mechanical Life: 150,000 Cycles; Supplier 1: Digi-Key; Supplier Part Number 1: 401-1429-6-ND; Manufacturer Part Number: KMR231GLFS; RoHS: RoHS Compliant; Category: Switches; Stock 1: 32289; Pricing 1: 1=0.44, 10=0.416, 25=0.3744, 50=0.3326, 100=0.3188, 250=0.29108, 500=0.2772, 1000=0.22869 (USD); Mounting Type: Surface Mount; Termination Style: Gull Wing; Illumination Voltage (Nominal): -; Illumination Type, Color: -; Ingress Protection: -; Features: Grounding Pin; Packaging: Digi-Reel®; Actuator Material: -; Operating Temperature: -40°C ~ 85°C; ComponentLink1URL: http://www.ck-components.com/index.php?module=media&action=Display&cmpref=14414&lang=en&width=&height=&format=&alt=; ComponentLink1Description: http://www.ck-components.com/index.php?module=media&action=Display&cmpref=14414&lang=en&width=&height=&format=&alt=